# EAGLE design cSTER_Space_Robotic_Arm_Schematic (EAGLE 9.6.2)

## Sheet 1 of 5
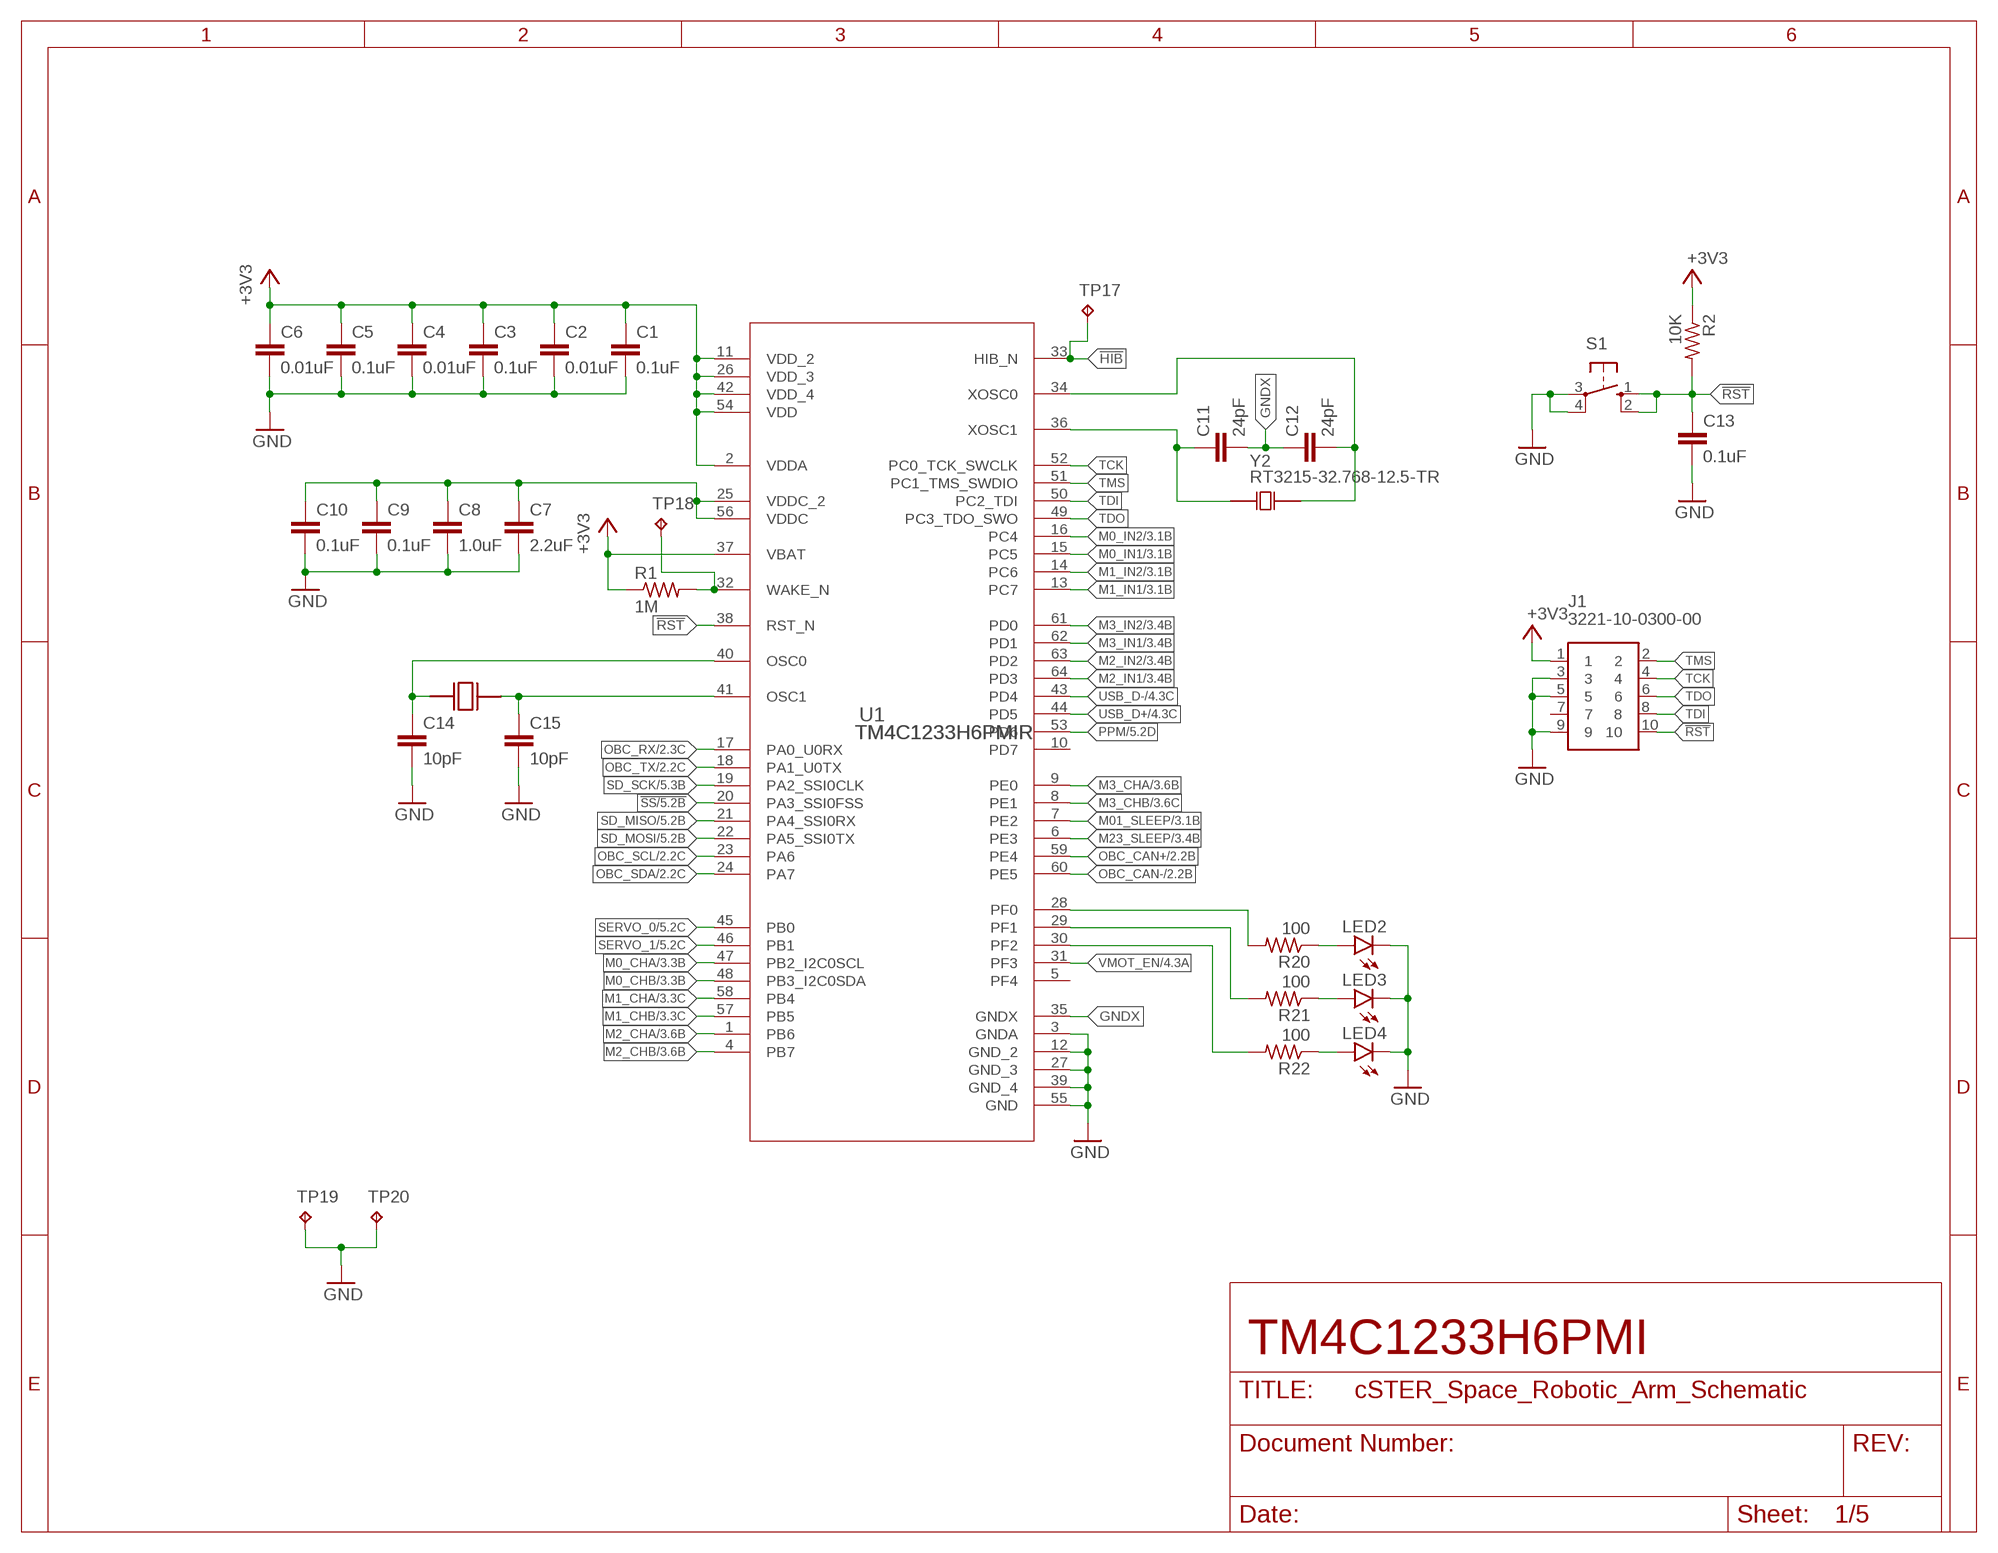
[diagram p0: schematic, sheet 1]

### Parts
C1  0.1uF  C-EUC0402K  [C0402K]
C2  0.01uF  C-EUC0402K  [C0402K]
C3  0.1uF  C-EUC0402K  [C0402K]
C4  0.01uF  C-EUC0402K  [C0402K]
C5  0.1uF  C-EUC0402K  [C0402K]
C6  0.01uF  C-EUC0402K  [C0402K]
C7  2.2uF  C-EUC0402K  [C0402K]
C8  1.0uF  C-EUC0402K  [C0402K]
C9  0.1uF  C-EUC0402K  [C0402K]
C10  0.1uF  C-EUC0402K  [C0402K]
C11  24pF  C-EUC0402K  [C0402K]
C12  24pF  C-EUC0402K  [C0402K]
C13  0.1uF  C-EUC0603  [C0603]
C14  10pF  C-EUC0402K  [C0402K]
C15  10pF  C-EUC0402K  [C0402K]
J1  3221-10-0300-00  [3221-10-0300-00]
LED2  LEDCHIPLED_0805  [CHIPLED_0805]
LED3  LEDCHIPLED_0805  [CHIPLED_0805]
LED4  LEDCHIPLED_0805  [CHIPLED_0805]
R1  1M  R-US_R0402  [R0402]
R2  10K  R-US_R0603  [R0603]
R20  100  R-US_R0603  [R0603]
R21  100  R-US_R0603  [R0603]
R22  100  R-US_R0603  [R0603]
S1  10-XX  [B3F-10XX]
TP17  TPPAD1-13  [P1-13]
TP18  TPPAD1-13  [P1-13]
TP19  TPPAD1-13  [P1-13]
TP20  TPPAD1-13  [P1-13]
U1  TM4C1233H6PMIR  [PM0064A_N]
Y1  ECS-160-9-42-CKM-TR  [XTAL_ECS-160-9-42-CKM-TR]
Y2  RT3215-32.768-12.5-TR  [RT3215-32.768-12.5-TR]

### Nets
!HIB: TP17.TP U1.33(HIB_N)
!RST: C13.1 J1.10 R2.2 S1.1(S) S1.2(S1) U1.38(RST_N)
!SS: U1.20(PA3_SSI0FSS) ; also sheet 5
+3V3: C1.1 C2.1 C3.1 C4.1 C5.1 C6.1 J1.1 R1.1 R2.1 U1.2(VDDA) U1.11(VDD_2) U1.26(VDD_3) U1.37(VBAT) U1.42(VDD_4) U1.54(VDD) ; also sheet 2,3,4,5
GND: C1.2 C2.2 C3.2 C4.2 C5.2 C6.2 C7.2 C8.2 C9.2 C10.2 C13.2 C14.2 C15.2 J1.3 J1.5 J1.9 LED2.C LED3.C LED4.C S1.3(P) S1.4(P1) TP19.TP TP20.TP U1.3(GNDA) U1.12(GND_2) U1.27(GND_3) U1.39(GND_4) U1.55(GND) ; also sheet 2,3,4,5
GNDX: C11.2 C12.1 U1.35(GNDX)
M0_CHA: U1.47(PB2_I2C0SCL) ; also sheet 3
M0_CHB: U1.48(PB3_I2C0SDA) ; also sheet 3
M0_IN1: U1.15(PC5) ; also sheet 3
M0_IN2: U1.16(PC4) ; also sheet 3
M1_CHA: U1.58(PB4) ; also sheet 3
M1_CHB: U1.57(PB5) ; also sheet 3
M1_IN1: U1.13(PC7) ; also sheet 3
M1_IN2: U1.14(PC6) ; also sheet 3
M01_SLEEP: U1.7(PE2) ; also sheet 3
M2_CHA: U1.1(PB6) ; also sheet 3
M2_CHB: U1.4(PB7) ; also sheet 3
M2_IN1: U1.64(PD3) ; also sheet 3
M2_IN2: U1.63(PD2) ; also sheet 3
M3_CHA: U1.9(PE0) ; also sheet 3
M3_CHB: U1.8(PE1) ; also sheet 3
M3_IN1: U1.62(PD1) ; also sheet 3
M3_IN2: U1.61(PD0) ; also sheet 3
M23_SLEEP: U1.6(PE3) ; also sheet 3
N$1: C11.1 U1.36(XOSC1) Y2.1
N$2: C14.1 U1.40(OSC0) Y1.1
N$3: C12.2 U1.34(XOSC0) Y2.2
N$4: R1.2 TP18.TP U1.32(WAKE_N)
N$5: C7.1 C8.1 C9.1 C10.1 U1.25(VDDC_2) U1.56(VDDC)
N$6: C15.1 U1.41(OSC1) Y1.3
N$24: LED2.A R20.1
N$28: LED3.A R21.1
N$34: LED4.A R22.1
N$38: R20.2 U1.28(PF0)
N$39: R21.2 U1.29(PF1)
N$40: R22.2 U1.30(PF2)
OBC_CAN+: U1.59(PE4) ; also sheet 2
OBC_CAN-: U1.60(PE5) ; also sheet 2
OBC_RX: U1.17(PA0_U0RX) ; also sheet 2
OBC_SCL: U1.23(PA6) ; also sheet 2
OBC_SDA: U1.24(PA7) ; also sheet 2
OBC_TX: U1.18(PA1_U0TX) ; also sheet 2
PPM: U1.53(PD6) ; also sheet 5
SD_MISO: U1.21(PA4_SSI0RX) ; also sheet 5
SD_MOSI: U1.22(PA5_SSI0TX) ; also sheet 5
SD_SCK: U1.19(PA2_SSI0CLK) ; also sheet 5
SERVO_0: U1.45(PB0) ; also sheet 5
SERVO_1: U1.46(PB1) ; also sheet 5
TCK: J1.4 U1.52(PC0_TCK_SWCLK)
TDI: J1.8 U1.50(PC2_TDI)
TDO: J1.6 U1.49(PC3_TDO_SWO)
TMS: J1.2 U1.51(PC1_TMS_SWDIO)
USB_D+: U1.44(PD5) ; also sheet 4
USB_D-: U1.43(PD4) ; also sheet 4
VMOT_EN: U1.31(PF3) ; also sheet 4
Unconnected: J1.7 U1.5(PF4) U1.10(PD7)

### Notes on the sheet
- TM4C1233H6PMI

## Sheet 2 of 5
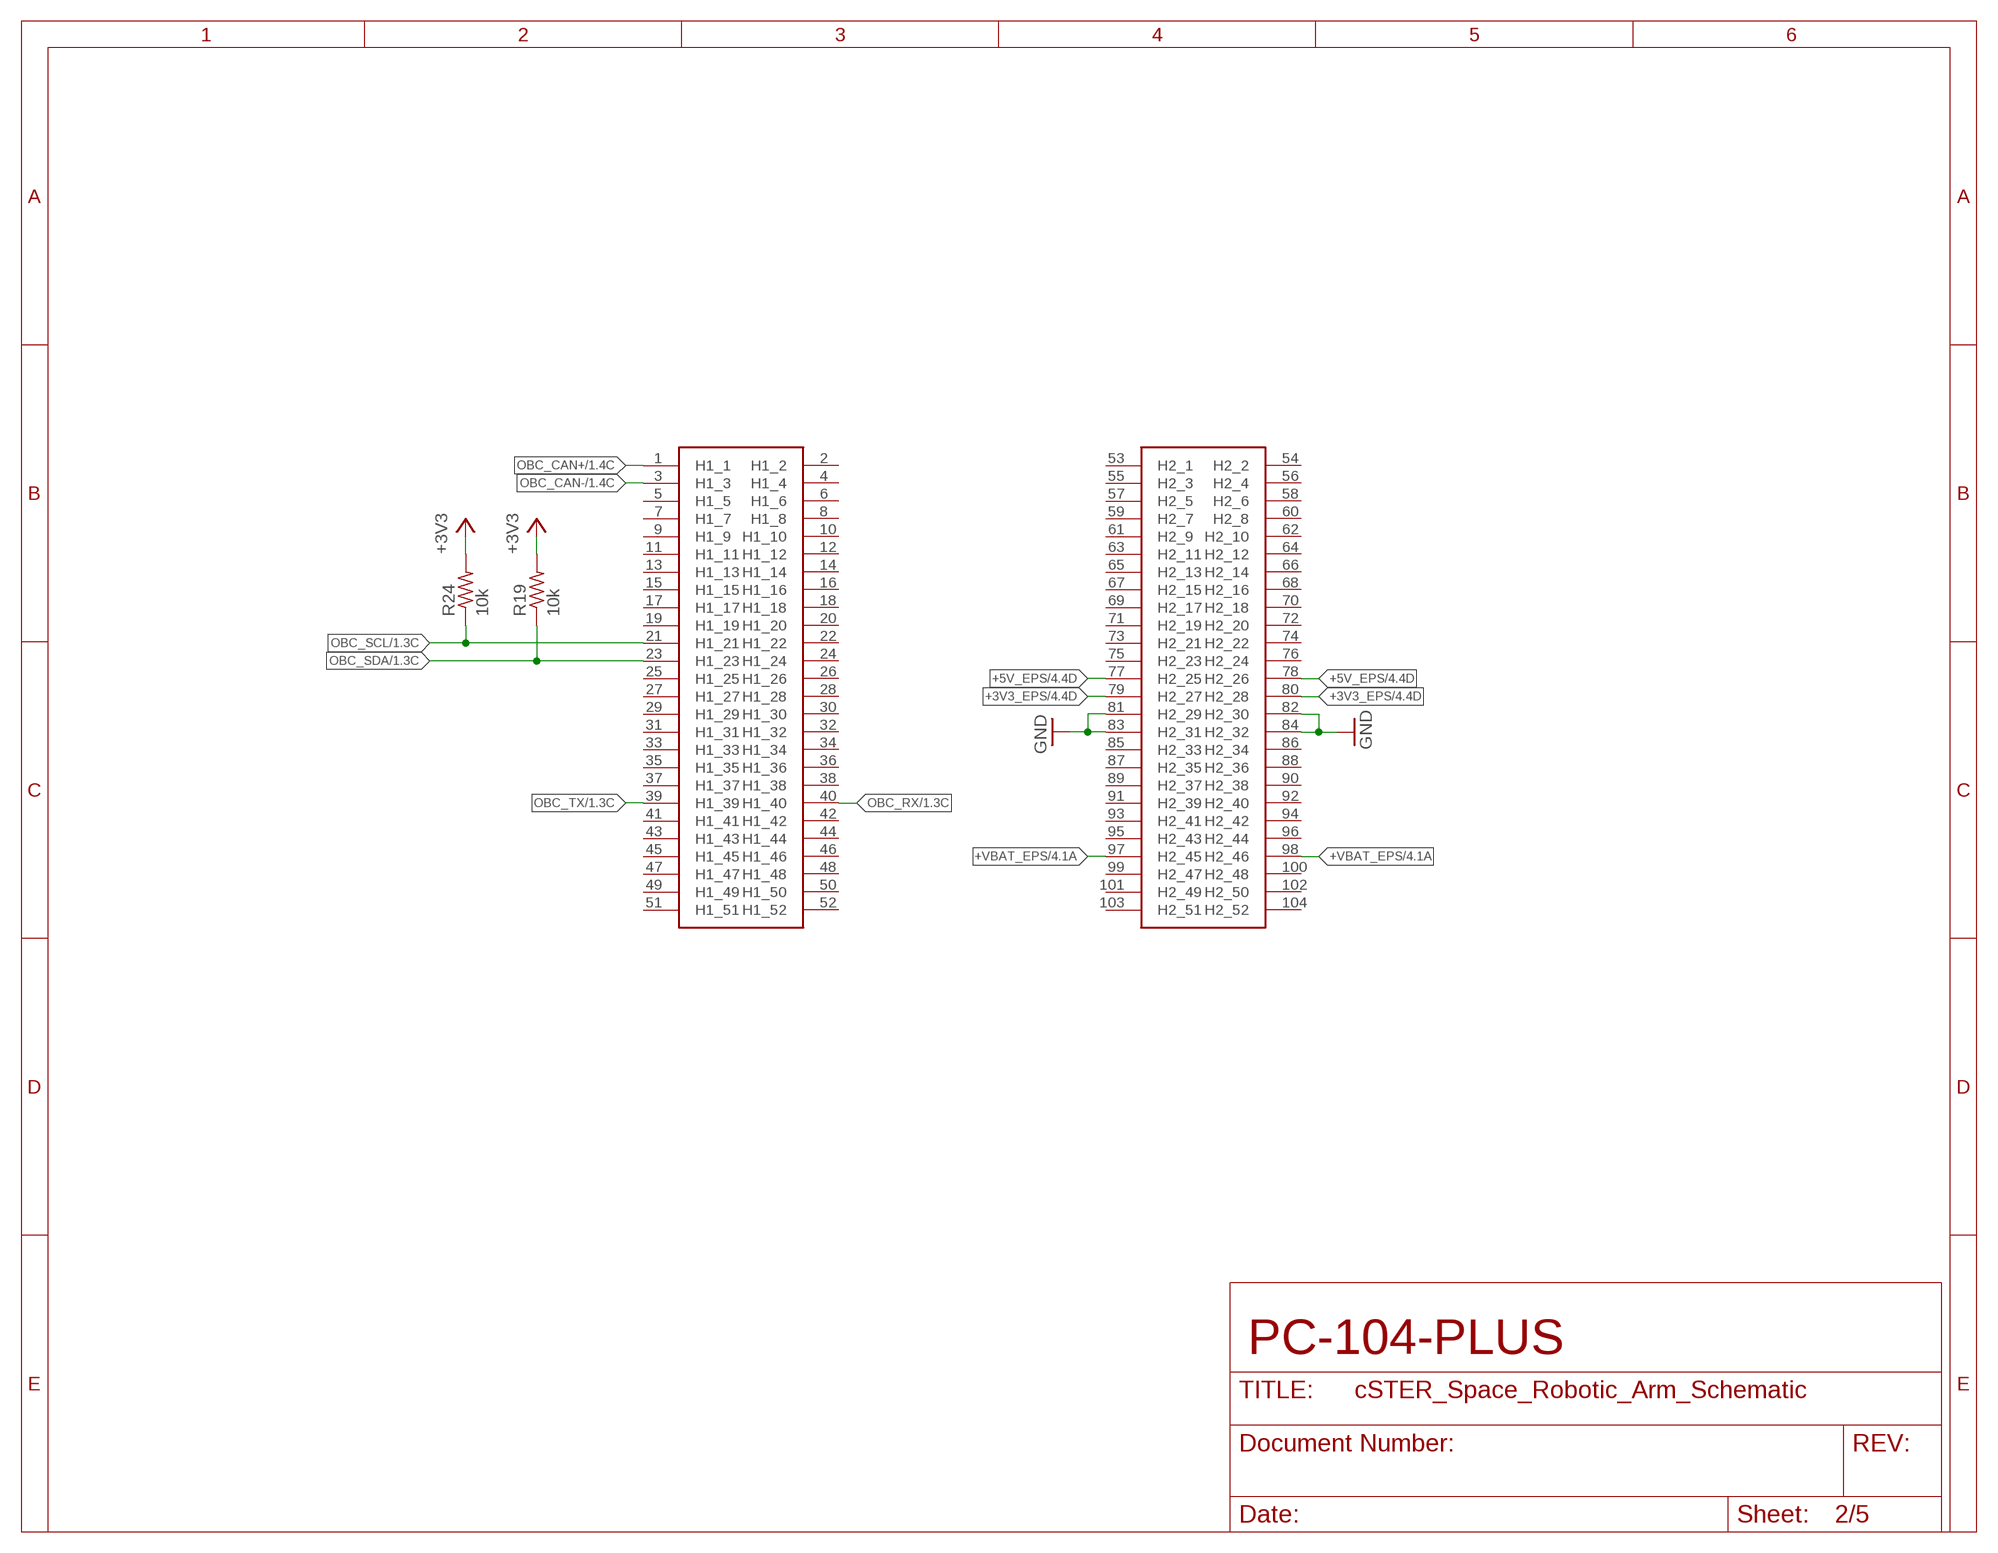
[diagram p1: schematic, sheet 2]

### Parts
J2  PC-104-PLUS  [PC-104-PLUS]
R19  10k  R-US_R0603  [R0603]
R24  10k  R-US_R0603  [R0603]

### Nets
+3V3: R19.2 R24.2 ; also sheet 1,3,4,5
+3V3_EPS: J2.79(H2_27) J2.80(H2_28) ; also sheet 4
+5V_EPS: J2.77(H2_25) J2.78(H2_26) ; also sheet 4
+VBAT_EPS: J2.97(H2_45) J2.98(H2_46) ; also sheet 4
GND: J2.81(H2_29) J2.82(H2_30) J2.83(H2_31) J2.84(H2_32) ; also sheet 1,3,4,5
OBC_CAN+: J2.1(H1_1) ; also sheet 1
OBC_CAN-: J2.3(H1_3) ; also sheet 1
OBC_RX: J2.40(H1_40) ; also sheet 1
OBC_SCL: J2.21(H1_21) R24.1 ; also sheet 1
OBC_SDA: J2.23(H1_23) R19.1 ; also sheet 1
OBC_TX: J2.39(H1_39) ; also sheet 1
Unconnected: J2.2(H1_2) J2.4(H1_4) J2.5(H1_5) J2.6(H1_6) J2.7(H1_7) J2.8(H1_8) J2.9(H1_9) J2.10(H1_10) J2.11(H1_11) J2.12(H1_12) J2.13(H1_13) J2.14(H1_14) J2.15(H1_15) J2.16(H1_16) J2.17(H1_17) J2.18(H1_18) J2.19(H1_19) J2.20(H1_20) J2.22(H1_22) J2.24(H1_24) J2.25(H1_25) J2.26(H1_26) J2.27(H1_27) J2.28(H1_28) J2.29(H1_29) J2.30(H1_30) J2.31(H1_31) J2.32(H1_32) J2.33(H1_33) J2.34(H1_34) J2.35(H1_35) J2.36(H1_36) J2.37(H1_37) J2.38(H1_38) J2.41(H1_41) J2.42(H1_42) J2.43(H1_43) J2.44(H1_44) J2.45(H1_45) J2.46(H1_46) J2.47(H1_47) J2.48(H1_48) J2.49(H1_49) J2.50(H1_50) J2.51(H1_51) J2.52(H1_52) J2.53(H2_1) J2.54(H2_2) J2.55(H2_3) J2.56(H2_4) J2.57(H2_5) J2.58(H2_6) J2.59(H2_7) J2.60(H2_8) J2.61(H2_9) J2.62(H2_10) J2.63(H2_11) J2.64(H2_12) J2.65(H2_13) J2.66(H2_14) J2.67(H2_15) J2.68(H2_16) J2.69(H2_17) J2.70(H2_18) J2.71(H2_19) J2.72(H2_20) J2.73(H2_21) J2.74(H2_22) J2.75(H2_23) J2.76(H2_24) J2.85(H2_33) J2.86(H2_34) J2.87(H2_35) J2.88(H2_36) J2.89(H2_37) J2.90(H2_38) J2.91(H2_39) J2.92(H2_40) J2.93(H2_41) J2.94(H2_42) J2.95(H2_43) J2.96(H2_44) J2.99(H2_47) J2.100(H2_48) J2.101(H2_49) J2.102(H2_50) J2.103(H2_51) J2.104(H2_52)

### Notes on the sheet
- PC-104-PLUS

## Sheet 3 of 5
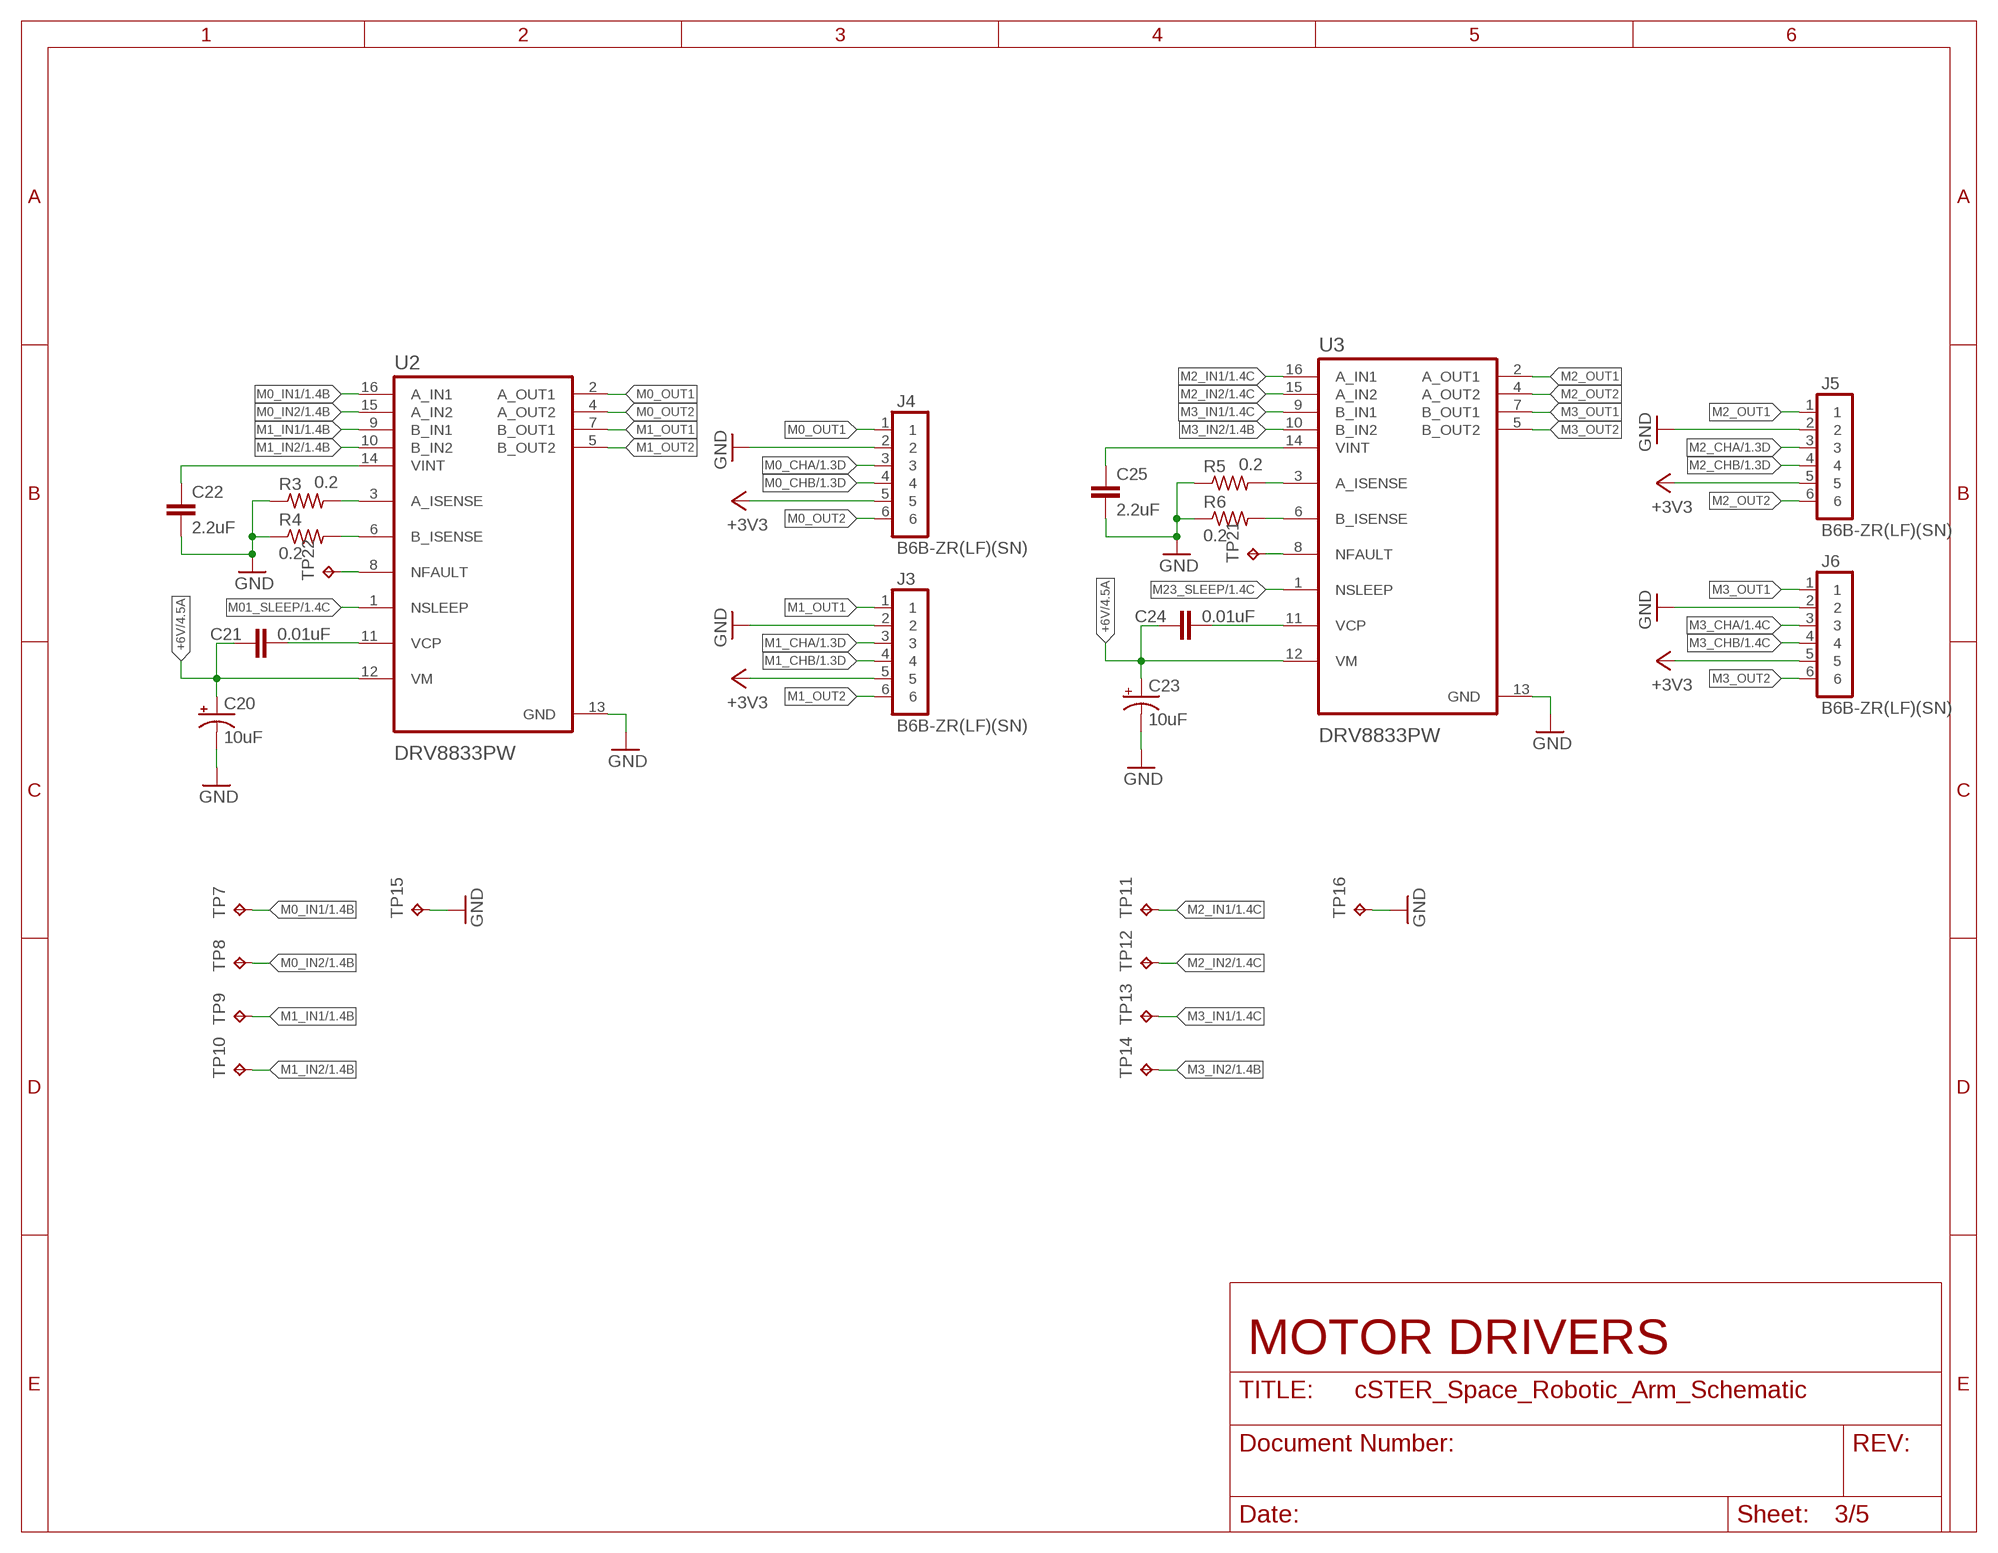
[diagram p2: schematic, sheet 3]

### Parts
C20  10uF  CPOL-USCT3216  [CT3216]
C21  0.01uF  C-EUC0805  [C0805]
C22  2.2uF  C-EUC0603  [C0603]
C23  10uF  CPOL-USCT3216  [CT3216]
C24  0.01uF  C-EUC0805  [C0805]
C25  2.2uF  C-EUC0603  [C0603]
J3  B6B-ZR(LF)(SN)  [JST_B6B-ZR(LF)(SN)]
J4  B6B-ZR(LF)(SN)  [JST_B6B-ZR(LF)(SN)]
J5  B6B-ZR(LF)(SN)  [JST_B6B-ZR(LF)(SN)]
J6  B6B-ZR(LF)(SN)  [JST_B6B-ZR(LF)(SN)]
R3  0.2  R-US_R1206  [R1206]
R4  0.2  R-US_R1206  [R1206]
R5  0.2  R-US_R1206  [R1206]
R6  0.2  R-US_R1206  [R1206]
TP7  TPPAD1-13  [P1-13]
TP8  TPPAD1-13  [P1-13]
TP9  TPPAD1-13  [P1-13]
TP10  TPPAD1-13  [P1-13]
TP11  TPPAD1-13  [P1-13]
TP12  TPPAD1-13  [P1-13]
TP13  TPPAD1-13  [P1-13]
TP14  TPPAD1-13  [P1-13]
TP15  TPPAD1-13  [P1-13]
TP16  TPPAD1-13  [P1-13]
TP21  TPPAD1-13  [P1-13]
TP22  TPPAD1-13  [P1-13]
U2  DRV8833PW  [SOP65P640X120-16N]
U3  DRV8833PW  [SOP65P640X120-16N]

### Nets
+3V3: J3.5 J4.5 J5.5 J6.5 ; also sheet 1,2,4,5
+6V: C20.+ C21.1 C23.+ C24.1 U2.12(VM) U3.12(VM) ; also sheet 4
GND: C20.- C22.2 C23.- C25.2 J3.2 J4.2 J5.2 J6.2 R3.1 R4.1 R5.1 R6.1 TP15.TP TP16.TP U2.13(GND) U3.13(GND) ; also sheet 1,2,4,5
M0_CHA: J4.3 ; also sheet 1
M0_CHB: J4.4 ; also sheet 1
M0_IN1: TP7.TP U2.16(A_IN1) ; also sheet 1
M0_IN2: TP8.TP U2.15(A_IN2) ; also sheet 1
M0_OUT1: J4.1 U2.2(A_OUT1)
M0_OUT2: J4.6 U2.4(A_OUT2)
M1_CHA: J3.3 ; also sheet 1
M1_CHB: J3.4 ; also sheet 1
M1_IN1: TP9.TP U2.9(B_IN1) ; also sheet 1
M1_IN2: TP10.TP U2.10(B_IN2) ; also sheet 1
M1_OUT1: J3.1 U2.7(B_OUT1)
M1_OUT2: J3.6 U2.5(B_OUT2)
M01_SLEEP: U2.1(NSLEEP) ; also sheet 1
M2_CHA: J5.3 ; also sheet 1
M2_CHB: J5.4 ; also sheet 1
M2_IN1: TP11.TP U3.16(A_IN1) ; also sheet 1
M2_IN2: TP12.TP U3.15(A_IN2) ; also sheet 1
M2_OUT1: J5.1 U3.2(A_OUT1)
M2_OUT2: J5.6 U3.4(A_OUT2)
M3_CHA: J6.3 ; also sheet 1
M3_CHB: J6.4 ; also sheet 1
M3_IN1: TP13.TP U3.9(B_IN1) ; also sheet 1
M3_IN2: TP14.TP U3.10(B_IN2) ; also sheet 1
M3_OUT1: J6.1 U3.7(B_OUT1)
M3_OUT2: J6.6 U3.5(B_OUT2)
M23_SLEEP: U3.1(NSLEEP) ; also sheet 1
N$8: R3.2 U2.3(A_ISENSE)
N$9: R4.2 U2.6(B_ISENSE)
N$10: C21.2 U2.11(VCP)
N$12: C22.1 U2.14(VINT)
N$13: R5.2 U3.3(A_ISENSE)
N$14: R6.2 U3.6(B_ISENSE)
N$15: C24.2 U3.11(VCP)
N$16: TP21.TP U3.8(NFAULT)
N$17: C25.1 U3.14(VINT)
N$18: TP22.TP U2.8(NFAULT)

### Notes on the sheet
- MOTOR DRIVERS

## Sheet 4 of 5
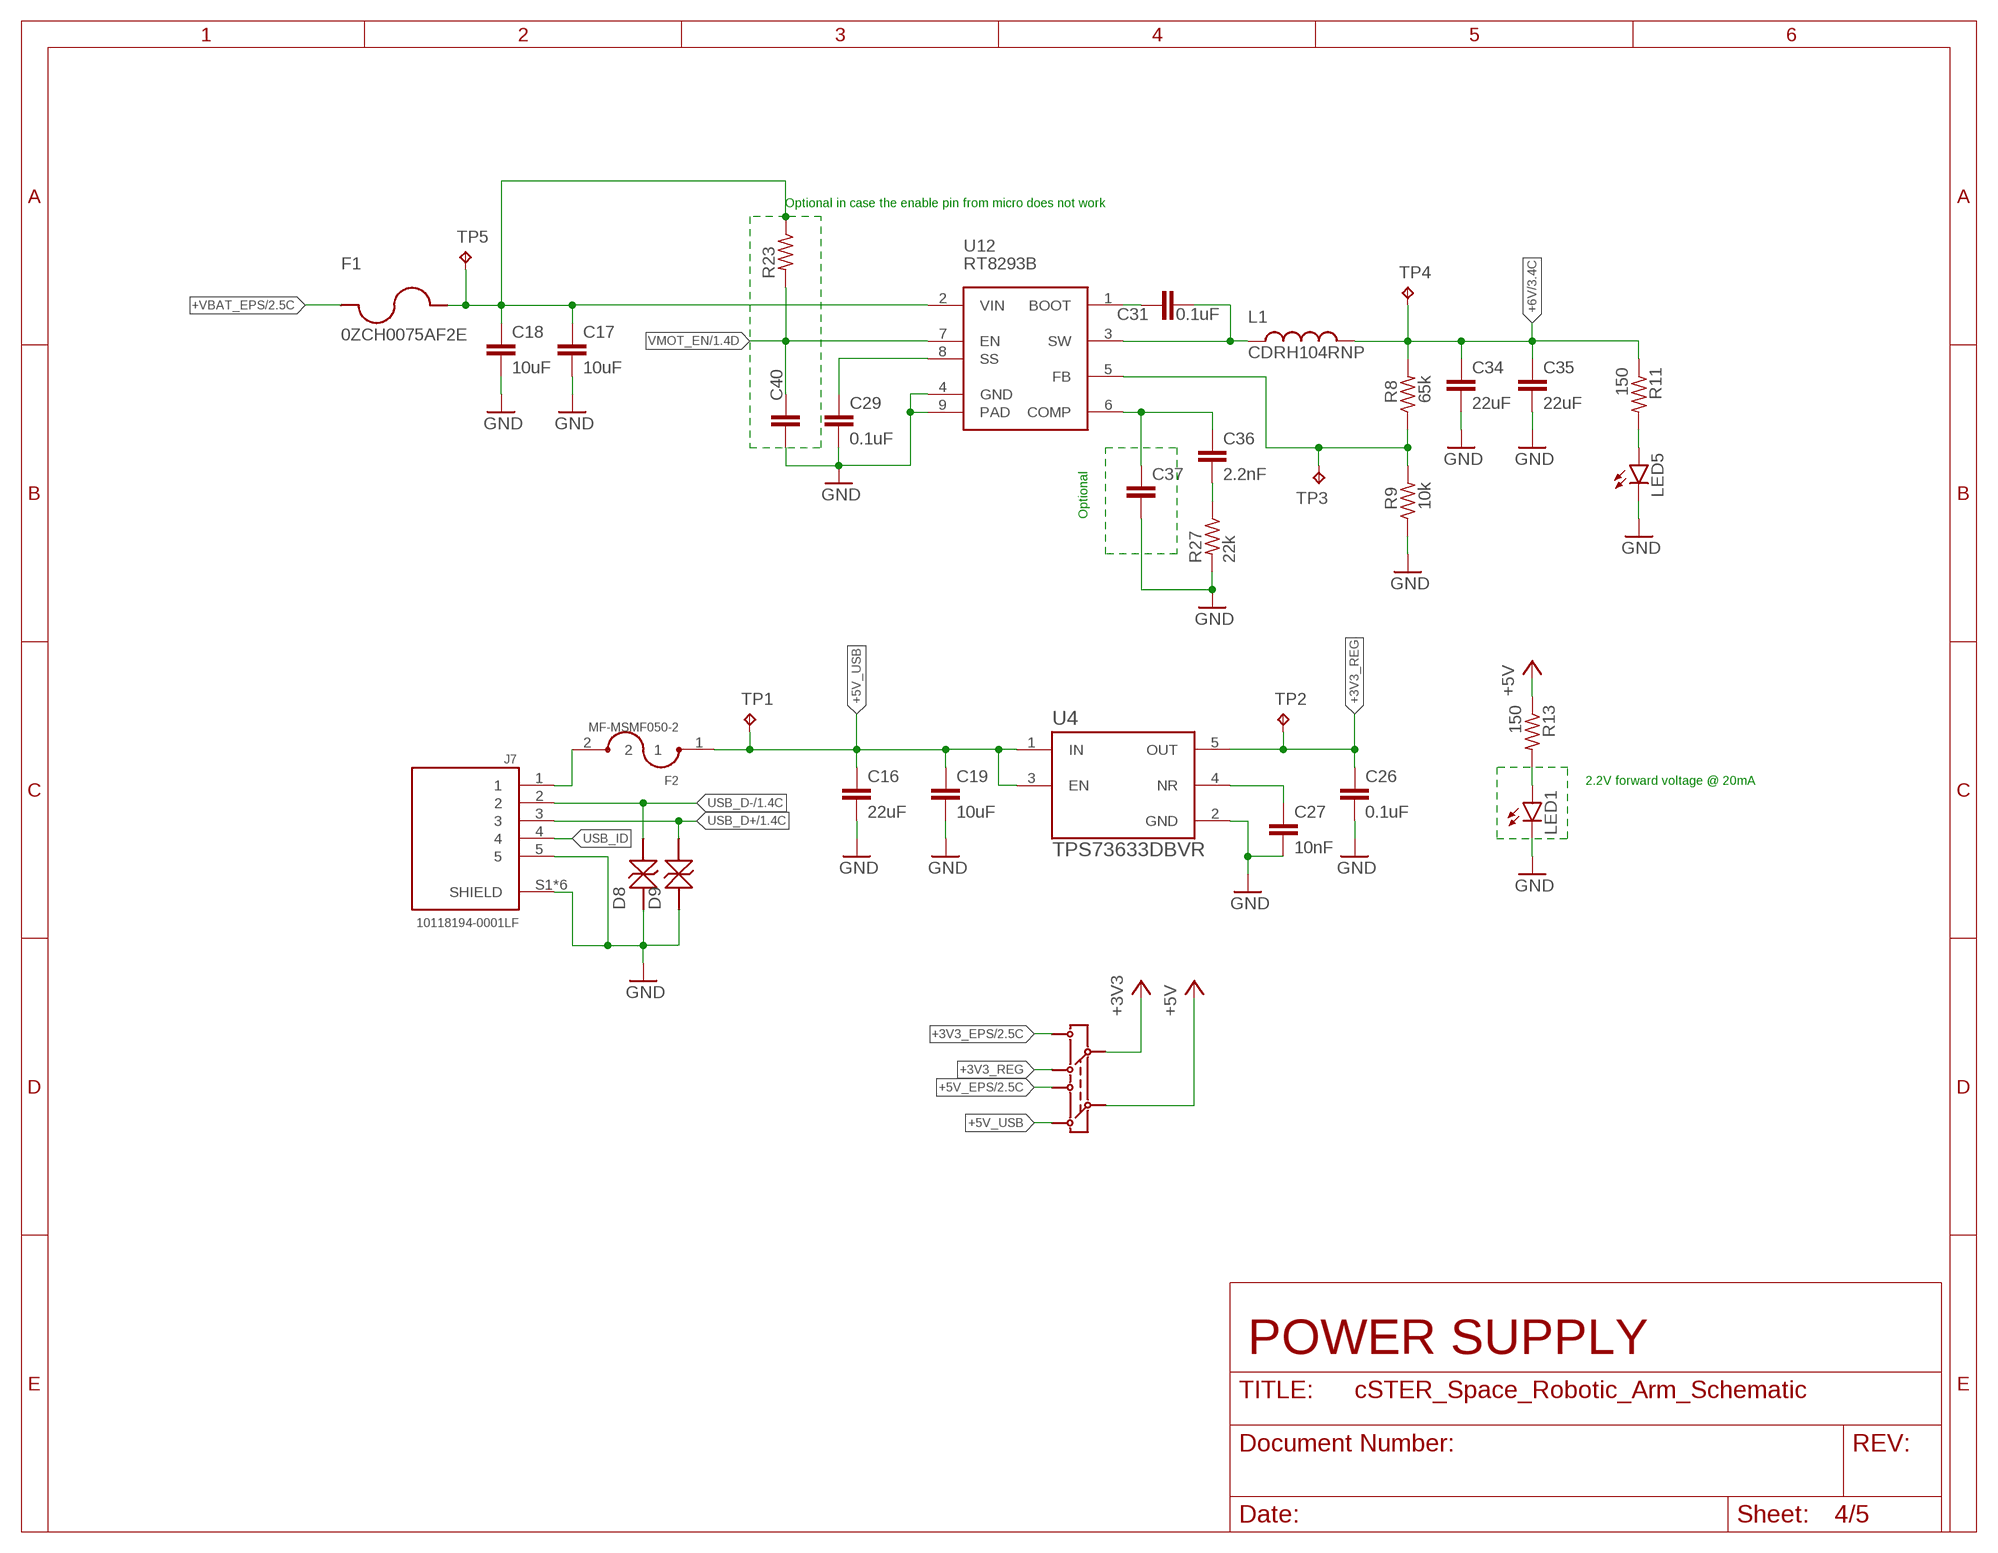
[diagram p3: schematic, sheet 4]

### Parts
C16  22uF  C-EUC1206  [C1206]
C17  10uF  C-EUC1206  [C1206]
C18  10uF  C-EUC1206  [C1206]
C19  10uF  C-EUC0603  [C0603]
C26  0.1uF  C-EUC0603  [C0603]
C27  10nF  C-EUC0603  [C0603]
C29  0.1uF  C-EUC0603  [C0603]
C31  0.1uF  C-EUC0603  [C0603]
C34  22uF  C-EUC1206  [C1206]
C35  22uF  C-EUC1206  [C1206]
C36  2.2nF  C-EUC0603  [C0603]
C37  C-EUC0603  [C0603]
C40  C-EUC0603  [C0603]
D8  CPDQC5V0R  [CPDQC5V0R]
D9  CPDQC5V0R  [CPDQC5V0R]
F1  0ZCH0075AF2E  [0ZCH0075AF2E]
F2  MF-MSMF050-2  [FUSM4632X85]
J7  10118194-0001LF  [AMPHENOL_10118194-0001LF]
L1  CDRH104RNP  [CDRH104RNP]
LED1  LEDCHIPLED_0805  [CHIPLED_0805]
LED5  LEDCHIPLED_0805  [CHIPLED_0805]
R8  65k  R-US_R0603  [R0603]
R9  10k  R-US_R0603  [R0603]
R11  150  R-US_R0603  [R0603]
R13  150  R-US_R0603  [R0603]
R23  R-US_R0603  [R0603]
R27  22k  R-US_R0603  [R0603]
TP1  TPPAD1-13  [P1-13]
TP2  TPPAD1-13  [P1-13]
TP3  TPPAD1-13  [P1-13]
TP4  TPPAD1-13  [P1-13]
TP5  TPPAD1-13  [P1-13]
U4  TPS73633DBVR  [SOT95P280X145-5N]
U12  RT8293B  [RT8293B]
U$1  JS202011CQN  [JS202011CQN]

### Nets
+3V3: U$1.5 ; also sheet 1,2,3,5
+3V3_EPS: U$1.6 ; also sheet 2
+3V3_REG: C26.1 TP2.TP U4.5(OUT) U$1.4
+5V: R13.1 U$1.2 ; also sheet 5
+5V_EPS: U$1.3 ; also sheet 2
+5V_USB: C16.1 C19.1 F2.1 TP1.TP U4.1(IN) U4.3(EN) U$1.1
+6V: C34.1 C35.1 L1.2 R8.2 R11.1 TP4.TP ; also sheet 3
+VBAT_EPS: F1.1 ; also sheet 2
GND: C16.2 C17.2 C18.2 C19.2 C26.2 C27.2 C29.2 C34.2 C35.2 C37.2 C40.1 D8.1 D9.1 J7.5 J7.S1(SHIELD) J7.S2(SHIELD) J7.S3(SHIELD) J7.S4(SHIELD) J7.S5(SHIELD) J7.S6(SHIELD) LED1.C LED5.C R9.1 R27.2 U4.2(GND) U12.4(GND) U12.9(PAD) ; also sheet 1,2,3,5
N$7: F2.2 J7.1
N$11: C31.1 U12.1(BOOT)
N$20: C27.1 U4.4(NR)
N$21: C29.1 U12.8(SS)
N$22: LED1.A R13.2
N$32: LED5.A R11.2
N$35: C31.2 L1.1 U12.3(SW)
N$36: R8.1 R9.2 TP3.TP U12.5(FB)
N$41: C36.1 C37.1 U12.6(COMP)
N$42: C36.2 R27.1
N$43: C17.1 C18.1 F1.2 R23.1 TP5.TP U12.2(VIN)
USB_D+: D9.2 J7.3 ; also sheet 1
USB_D-: D8.2 J7.2 ; also sheet 1
USB_ID: J7.4
VMOT_EN: C40.2 R23.2 U12.7(EN) ; also sheet 1

### Notes on the sheet
- Optional in case the enable pin from micro does not work
- Optional
- 2.2V forward voltage @ 20mA
- POWER SUPPLY

## Sheet 5 of 5
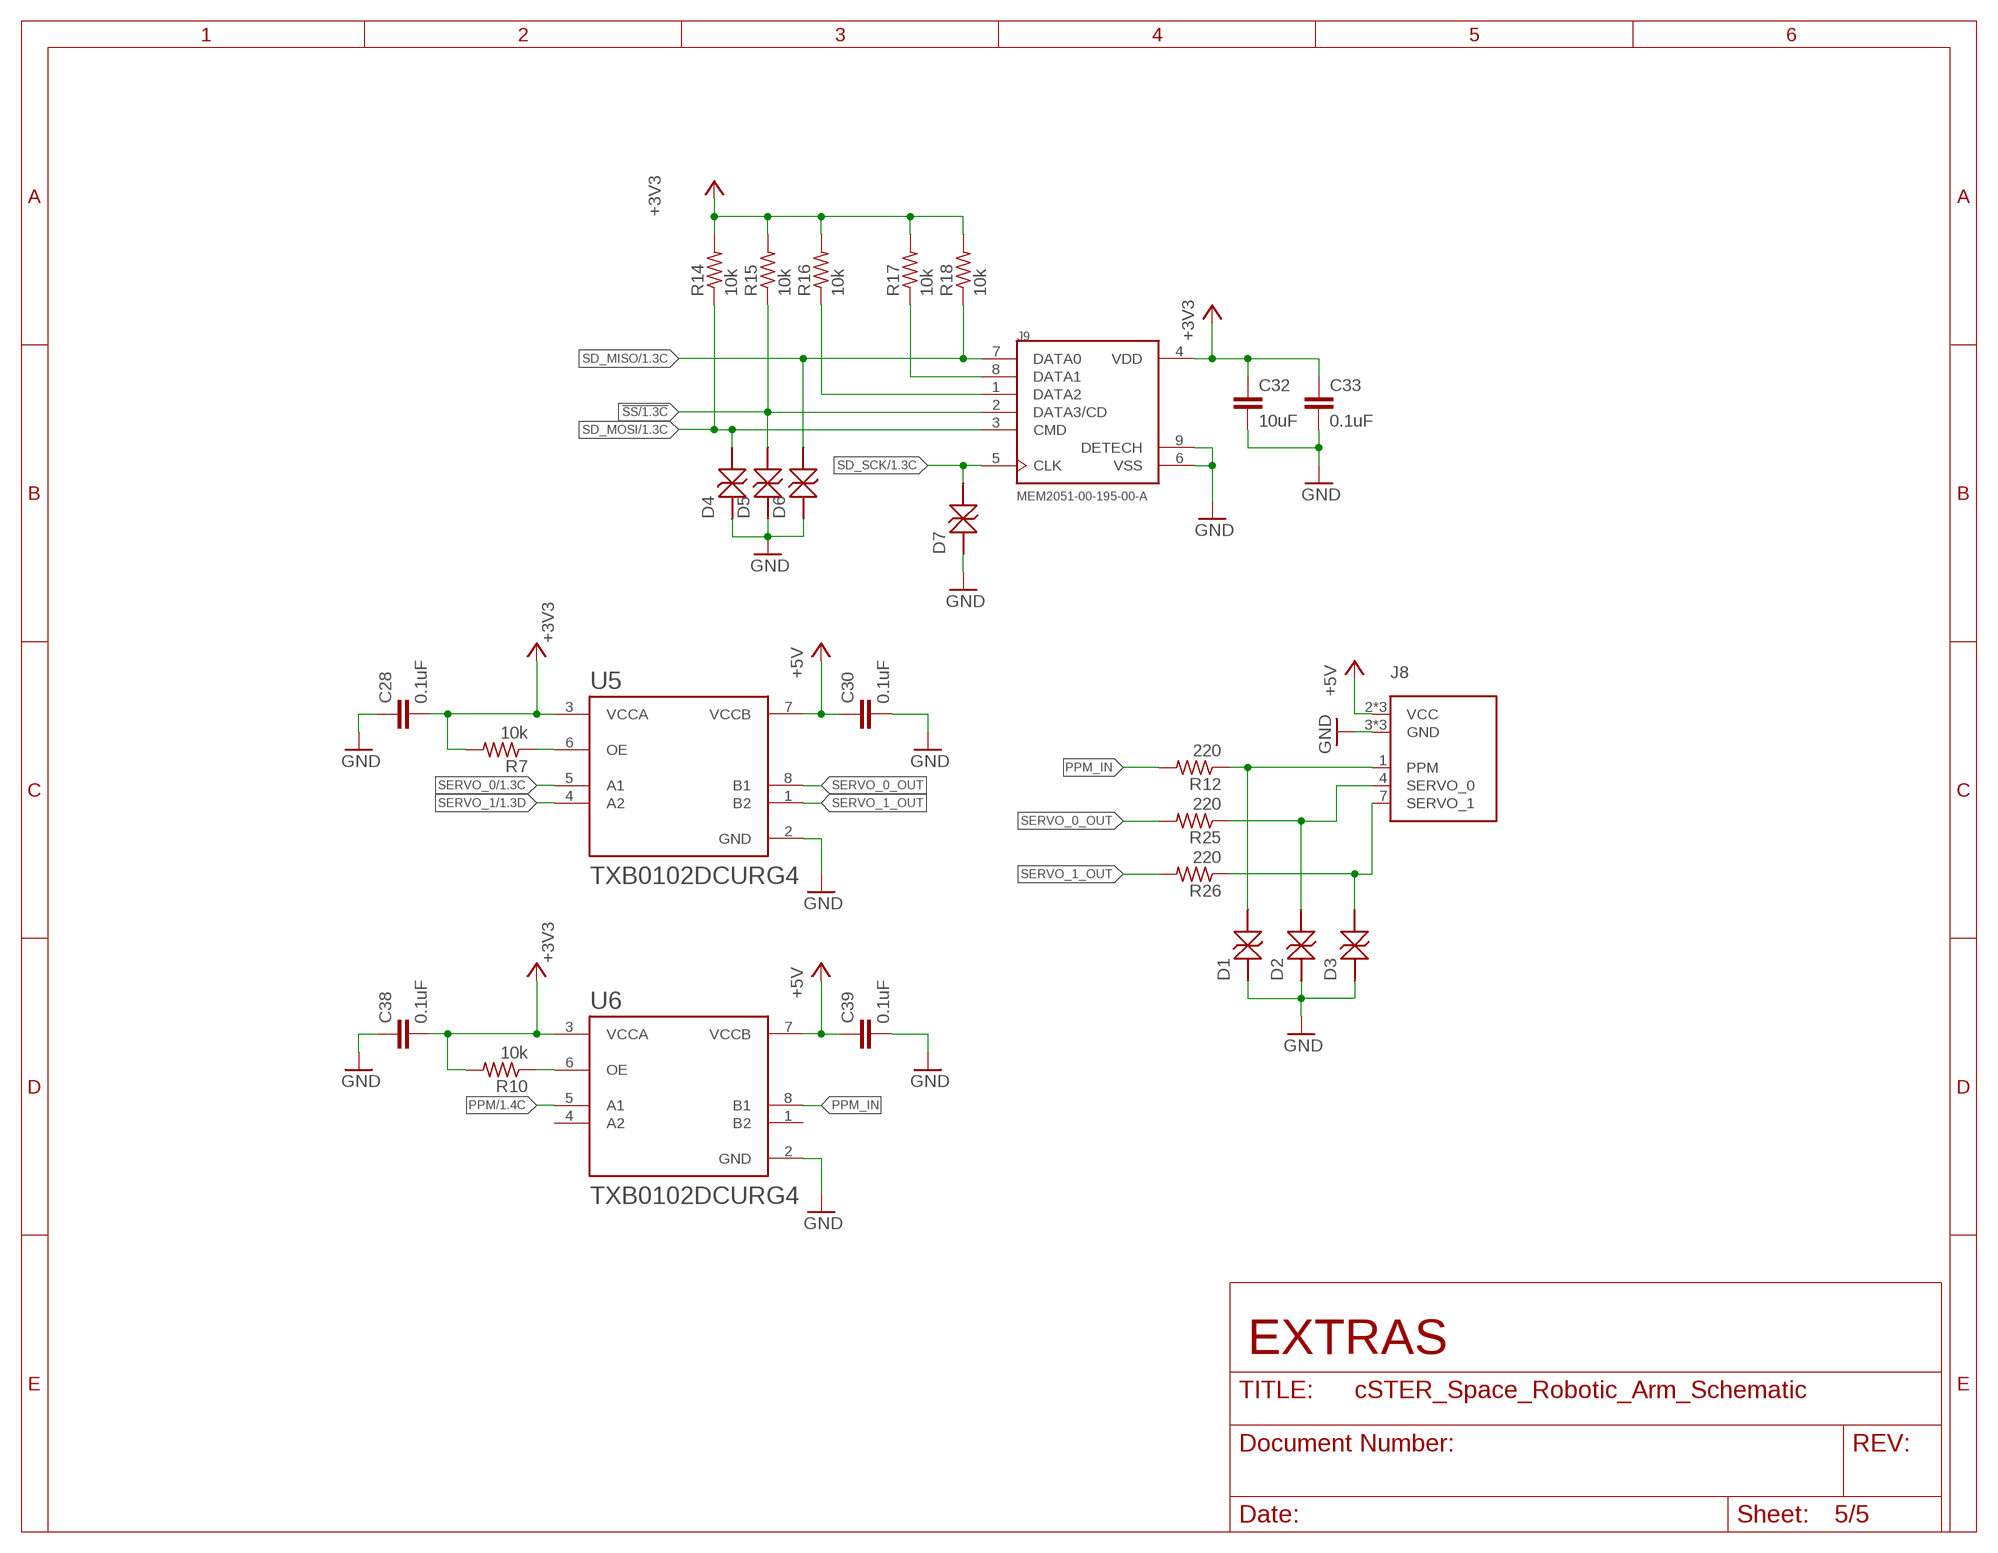
[diagram p4: schematic, sheet 5]

### Parts
C28  0.1uF  C-EUC0402K  [C0402K]
C30  0.1uF  C-EUC0402K  [C0402K]
C32  10uF  C-EUC0603  [C0603]
C33  0.1uF  C-EUC0603  [C0603]
C38  0.1uF  C-EUC0402K  [C0402K]
C39  0.1uF  C-EUC0402K  [C0402K]
D1  CPDQC5V0R  [CPDQC5V0R]
D2  CPDQC5V0R  [CPDQC5V0R]
D3  CPDQC5V0R  [CPDQC5V0R]
D4  CPDQC5V0R  [CPDQC5V0R]
D5  CPDQC5V0R  [CPDQC5V0R]
D6  CPDQC5V0R  [CPDQC5V0R]
D7  CPDQC5V0R  [CPDQC5V0R]
J8  ROBOT_PORT  [ROBOT_PORT]
J9  MEM2051-00-195-00-A  [GCT_MEM2051-00-195-00-A]
R7  10k  R-US_R0402  [R0402]
R10  10k  R-US_R0402  [R0402]
R12  220  R-US_R0603  [R0603]
R14  10k  R-US_R0603  [R0603]
R15  10k  R-US_R0603  [R0603]
R16  10k  R-US_R0603  [R0603]
R17  10k  R-US_R0603  [R0603]
R18  10k  R-US_R0603  [R0603]
R25  220  R-US_R0603  [R0603]
R26  220  R-US_R0603  [R0603]
U5  TXB0102DCURG4  [SOP50P310X90-8N]
U6  TXB0102DCURG4  [SOP50P310X90-8N]

### Nets
!SS: D5.2 J9.2(DATA3/CD) R15.1 ; also sheet 1
+3V3: C28.2 C32.1 C33.1 C38.2 J9.4(VDD) R7.2 R10.2 R14.2 R15.2 R16.2 R17.2 R18.2 U5.3(VCCA) U6.3(VCCA) ; also sheet 1,2,3,4
+5V: C30.1 C39.1 J8.2(VCC) J8.5(VCC) J8.8(VCC) U5.7(VCCB) U6.7(VCCB) ; also sheet 4
GND: C28.1 C30.2 C32.2 C33.2 C38.1 C39.2 D1.1 D2.1 D3.1 D4.1 D5.1 D6.1 D7.1 J8.3(GND) J8.6(GND) J8.9(GND) J9.6(VSS) J9.9(DETECH) U5.2(GND) U6.2(GND) ; also sheet 1,2,3,4
N$19: R7.1 U5.6(OE)
N$23: D3.2 J8.7(SERVO_1) R26.1
N$25: J9.8(DATA1) R17.1
N$26: J9.1(DATA2) R16.1
N$27: D2.2 J8.4(SERVO_0) R25.1
N$30: R10.1 U6.6(OE)
N$31: D1.2 J8.1(PPM) R12.1
PPM: U6.5(A1) ; also sheet 1
PPM_IN: R12.2 U6.8(B1)
SD_MISO: D6.2 J9.7(DATA0) R18.1 ; also sheet 1
SD_MOSI: D4.2 J9.3(CMD) R14.1 ; also sheet 1
SD_SCK: D7.2 J9.5(CLK) ; also sheet 1
SERVO_0: U5.5(A1) ; also sheet 1
SERVO_0_OUT: R25.2 U5.8(B1)
SERVO_1: U5.4(A2) ; also sheet 1
SERVO_1_OUT: R26.2 U5.1(B2)
Unconnected: U6.1(B2) U6.4(A2)

### Notes on the sheet
- EXTRAS

## Library data of the parts
C1-C19 C21 C22 C24-C40 = rcl:C-EU: CAPACITOR, European symbol; SPICEPREFIX: C
C20 C23 = rcl:CPOL-US: POLARIZED CAPACITOR, American symbol; SPICEPREFIX: C
D1-D9 = CPDQC5V0R:CPDQC5V0R
F1 = 0ZCH0075AF2E:0ZCH0075AF2E
F2 = MF-MSMF050-2:MF-MSMF050-2: PTC Resettable Fuse 0.5A(hold) 1A(trip) 15V 100A 0.8W 0.15s 0.15Ohm SMD Solder Pad 1812 T/R; DESCRIPTION: Polymeric PTC Resettable Fuse 15V 500 mA Ih Surface Mount 1812 (4532 Metric), Concave; DIGI-KEY_PART_NUMBER: MF-MSMF050-2CT-ND; MF: Bourns; MP: MF-MSMF050-2; PACKAGE: 1812 Bourns; PURCHASE-URL: https://pricing.snapeda.com/search/part/MF-MSMF050-2/?ref=eda
J1 = 3221-10-0300-00:3221-10-0300-00
J2 = PC-104_plus:PC-104-PLUS
J3-J6 = B6B-ZR_LF__SN_:B6B-ZR(LF)(SN): ZR Series 1.5 mm Pitch 6 Position Through Hole Top Entry Shrouded Heade; DESCRIPTION: Connector Header Through Hole 6 position 0.059 (1.50mm); DIGI-KEY_PART_NUMBER: 455-1661-ND; MF: JST Sales; MP: B6B-ZR(LF)(SN); PACKAGE: None
J7 = 10118194-0001LF:10118194-0001LF: Micro Usb, 2.0 Type b, Rcpt, Smt; DESCRIPTION: USB - micro B USB 2.0 Receptacle Connector 5 Position Surface Mount, Right Angle; Through Hole; DIGI-KEY_PART_NUMBER: 609-4618-1-ND; MF: Amphenol ICC (FCI); MP: 10118194-0001LF; PACKAGE: None; PURCHASE-URL: https://pricing.snapeda.com/search/part/10118194-0001LF/?ref=eda
J8 = CUBESAT_PORT:ROBOT_PORT
J9 = MEM2051-00-195-00-A:MEM2051-00-195-00-A: Connector, Memory Card, Micro Sd, 8 Position, 1.1mm, Full Reel; DESCRIPTION: 9 (8 + 1) Position Card Connector microSD Surface Mount, Right Angle Gold, 1.95mm profile, Normally open switch, Push push, Top mount; MF: Global Connector Technology; MP: MEM2051-00-195-00-A; PACKAGE: None; PURCHASE-URL: https://pricing.snapeda.com/search/part/MEM2051-00-195-00-A/?ref=eda
L1 = CDRH104RNP:CDRH104RNP
LED1-LED5 = led:LED: LED OSRAM: - CHIPLED LG R971, LG N971, LY N971, LG Q971, LY Q971, LO R971, LY R971 LH N974, LH R974 LS Q976, LO Q976, LY Q976 LO Q996 - Hyper CHIPLED LW Q18S LB Q993, LB Q99A, LB R99A - SideLED LS A670, LO A670, LY A670, LG A670, LP A670 LB A673, LV A673, LT A673, LW A673 LH A674 LY A675 LS A676, LA A676, LO A676, LY A676, LW A676 LS A679, LY A679, LG A679 - Hyper Micro SIDELED® LS Y876, LA Y876, LO Y876, LY Y876 LT Y87S - SmartLED LW L88C, LW L88S LB L89C, LB L89S, LG L890 LS L89K, LO L89K, LY L89K LS L896, LA L896, LO L896, LY L896 - TOPLED LS T670, LO T670, LY T670, LG T670, LP T670 LSG T670, LSP T670, LSY T670, LOP T670, LYG T670 LG T671, LOG T671, LSG T671 LB T673, LV T673, LT T673, LW T673 LH T674 LS T676, LA T676, LO T676, LY T676, LB T676, LH T676, LSB T676, LW T676 LB T67C, LV T67C, LT T67C, LS T67K, LO T67K, LY T67K, LW E67C LS E67B, LA E67B, LO E67B, LY E67B, LB E67C, LV E67C, LT E67C LW T67C LS T679, LY T679, LG T679 LS T770, LO T770, LY T770, LG T770, LP T770 LB T773, LV T773, LT T773, LW T773 LH T774 LS E675, LA E675, LY E675, LS T675 LS T776, LA T776, LO T776, LY T776, LB T776 LHGB T686 LT T68C, LB T68C - Hyper Mini TOPLED® LB M676 - Mini TOPLED Santana® LG M470 LS M47K, LO M47K, LY M47K Source: http://www.osram.convergy.de LUXEON: - LUMILED® LXK2-PW12-R00, LXK2-PW12-S00, LXK2-PW14-U00, LXK2-PW14-V00 LXK2-PM12-R00, LXK2-PM12-S00, LXK2-PM14-U00 LXK2-PE12-Q00, LXK2-PE12-R00, LXK2-PE12-S00, LXK2-PE14-T00, LXK2-PE14-U00 LXK2-PB12-K00, LXK2-PB12-L00, LXK2-PB12-M00, LXK2-PB14-N00, LXK2-PB14-P00, LXK2-PB14-Q00 LXK2-PR12-L00, LXK2-PR12-M00, LXK2-PR14-Q00, LXK2-PR14-R00 LXK2-PD12-Q00, LXK2-PD12-R00, LXK2-PD12-S00 LXK2-PH12-R00, LXK2-PH12-S00 LXK2-PL12-P00, LXK2-PL12-Q00, LXK2-PL12-R00 Source: www.luxeon.com KINGBRIGHT: KA-3528ASYC Source: www.kingbright.com
R1-R27 = rcl:R-US_: RESISTOR, American symbol; SPICEPREFIX: R
S1 = switch-omron:10-XX: OMRON SWITCH; MPN: B3F-1000; OC_FARNELL: 176432; OC_NEWARK: 36M3542
TP1-TP5 TP7-TP22 = testpad:TP: Test pad
U1 = TM4C1233H6PMI:TM4C1233H6PMIR; COPYRIGHT: Copyright (C) 2021 Ultra Librarian. All rights reserved.; DIGI-KEY_PART_NUMBER_1: TM4C1233H6PMIR-ND; MANUFACTURER_PART_NUMBER: TM4C1233H6PMIR; MFR_NAME: Texas Instruments; REFDES: RefDes; TYPE: TYPE
U2 U3 = DRV8833PW:DRV8833PW; DESCRIPTION: 10.8-V, 2-A dual H-bridge motor driver with current regulation 16-TSSOP -40 to 85; DIGI-KEY_PART_NUMBER: 296-29394-5-ND; MF: Texas Instruments; MP: DRV8833PW; PACKAGE: TSSOP-16 Texas Instruments; PURCHASE-URL: https://pricing.snapeda.com/search/part/DRV8833PW/?ref=eda
U4 = TPS73633DBVR:TPS73633DBVR: 400-mA, high-accuracy, ultra-low-dropout voltage regulator with reverse current protection and enable 5-SOT-23 -40 to 125; DESCRIPTION: 400-mA, high-accuracy, ultra-low-dropout voltage regulator with reverse current protection & enable 5-SOT-23 -40 to 125; DIGI-KEY_PART_NUMBER: 296-27064-1-ND; MF: Texas Instruments; MP: TPS73633DBVR; PACKAGE: SOT-23-5 Texas Instruments; PURCHASE-URL: https://pricing.snapeda.com/search/part/TPS73633DBVR/?ref=eda
U5 U6 = TXB0102DCURG4:TXB0102DCURG4: 2-Bit Bidirectional Voltage-Level Shifter with Auto Direction Sensing and +/-15-kV ESD Protect 8-VSSOP -40 to 85; DESCRIPTION: 2-Bit Bidirectional Voltage-Level Shifter with Auto Direction Sensing and +/-15-kV ESD Protect 8-VSSOP -40 to 85; DIGI-KEY_PART_NUMBER: 296-52836-2-ND; MF: Texas Instruments; MP: TXB0102DCURG4; PACKAGE: VSSOP-8 Texas Instruments; PURCHASE-URL: https://pricing.snapeda.com/search/part/TXB0102DCURG4/?ref=eda
U12 = RT8293B:RT8293B
U$1 = JS202011CQN:JS202011CQN
Y1 = ECS-160-9-42-CKM-TR:ECS-160-9-42-CKM-TR: Crystal 4-SMD, No Lead; DESCRIPTION: 16 MHz ±10ppm Crystal 9pF 60 Ohms 4-SMD, No Lead; DIGI-KEY_PART_NUMBER: XC1611CT-ND; MF: ECS Inc.; MP: ECS-160-9-42-CKM-TR; PACKAGE: SMD-4 ECS International; PURCHASE-URL: https://pricing.snapeda.com/search/part/ECS-160-9-42-CKM-TR/?ref=eda
Y2 = RT3215-32.768-12.5-TR:RT3215-32.768-12.5-TR

## Board
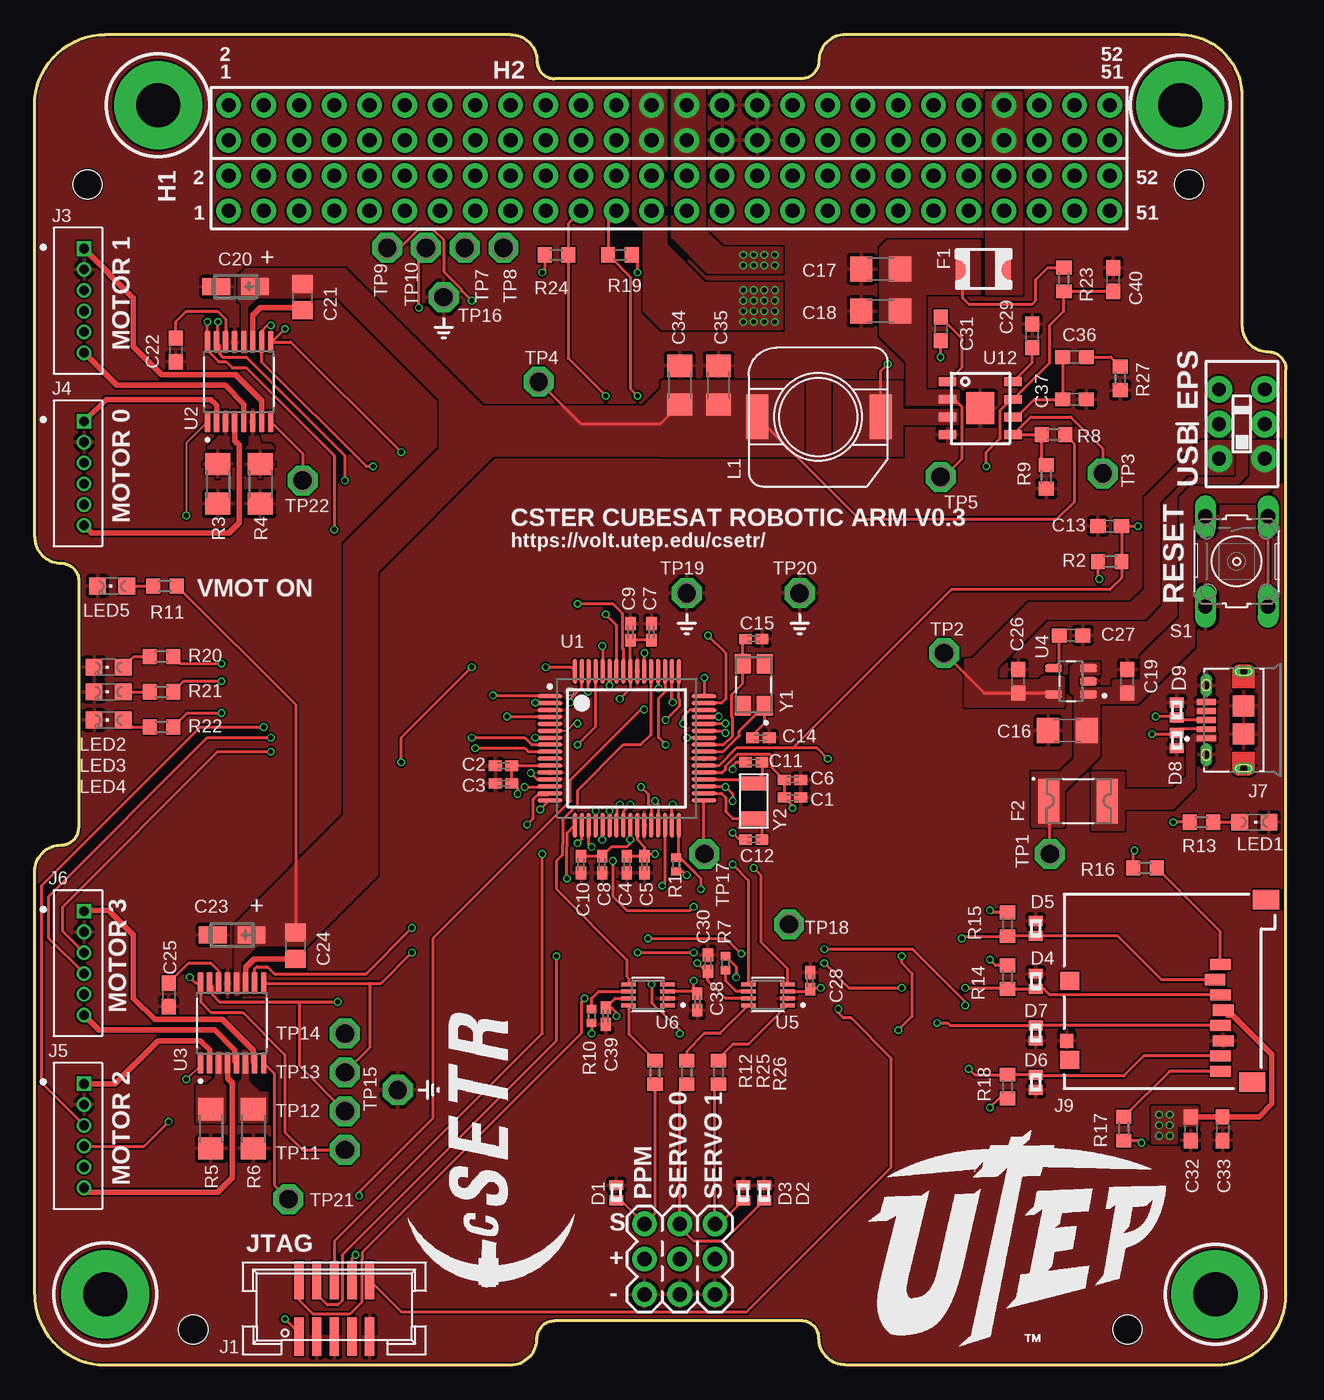
[diagram p5: board, top side]
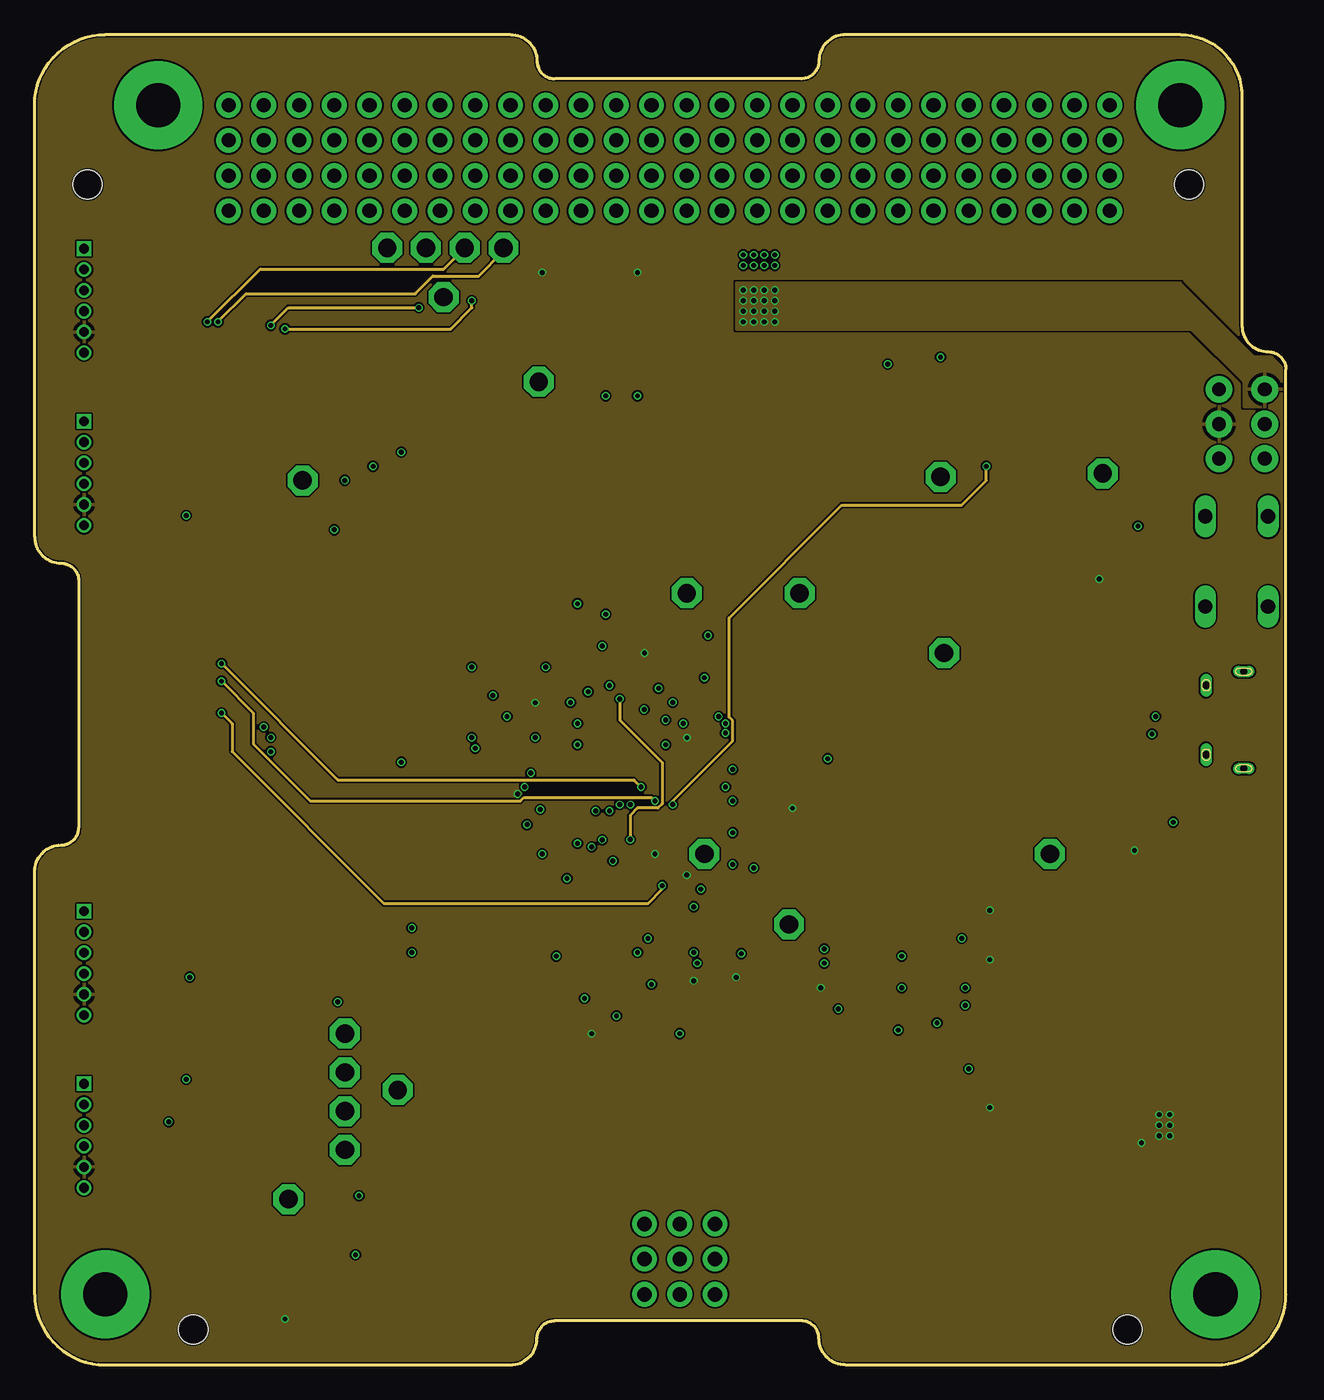
[diagram p6: board, inner layer Route2]
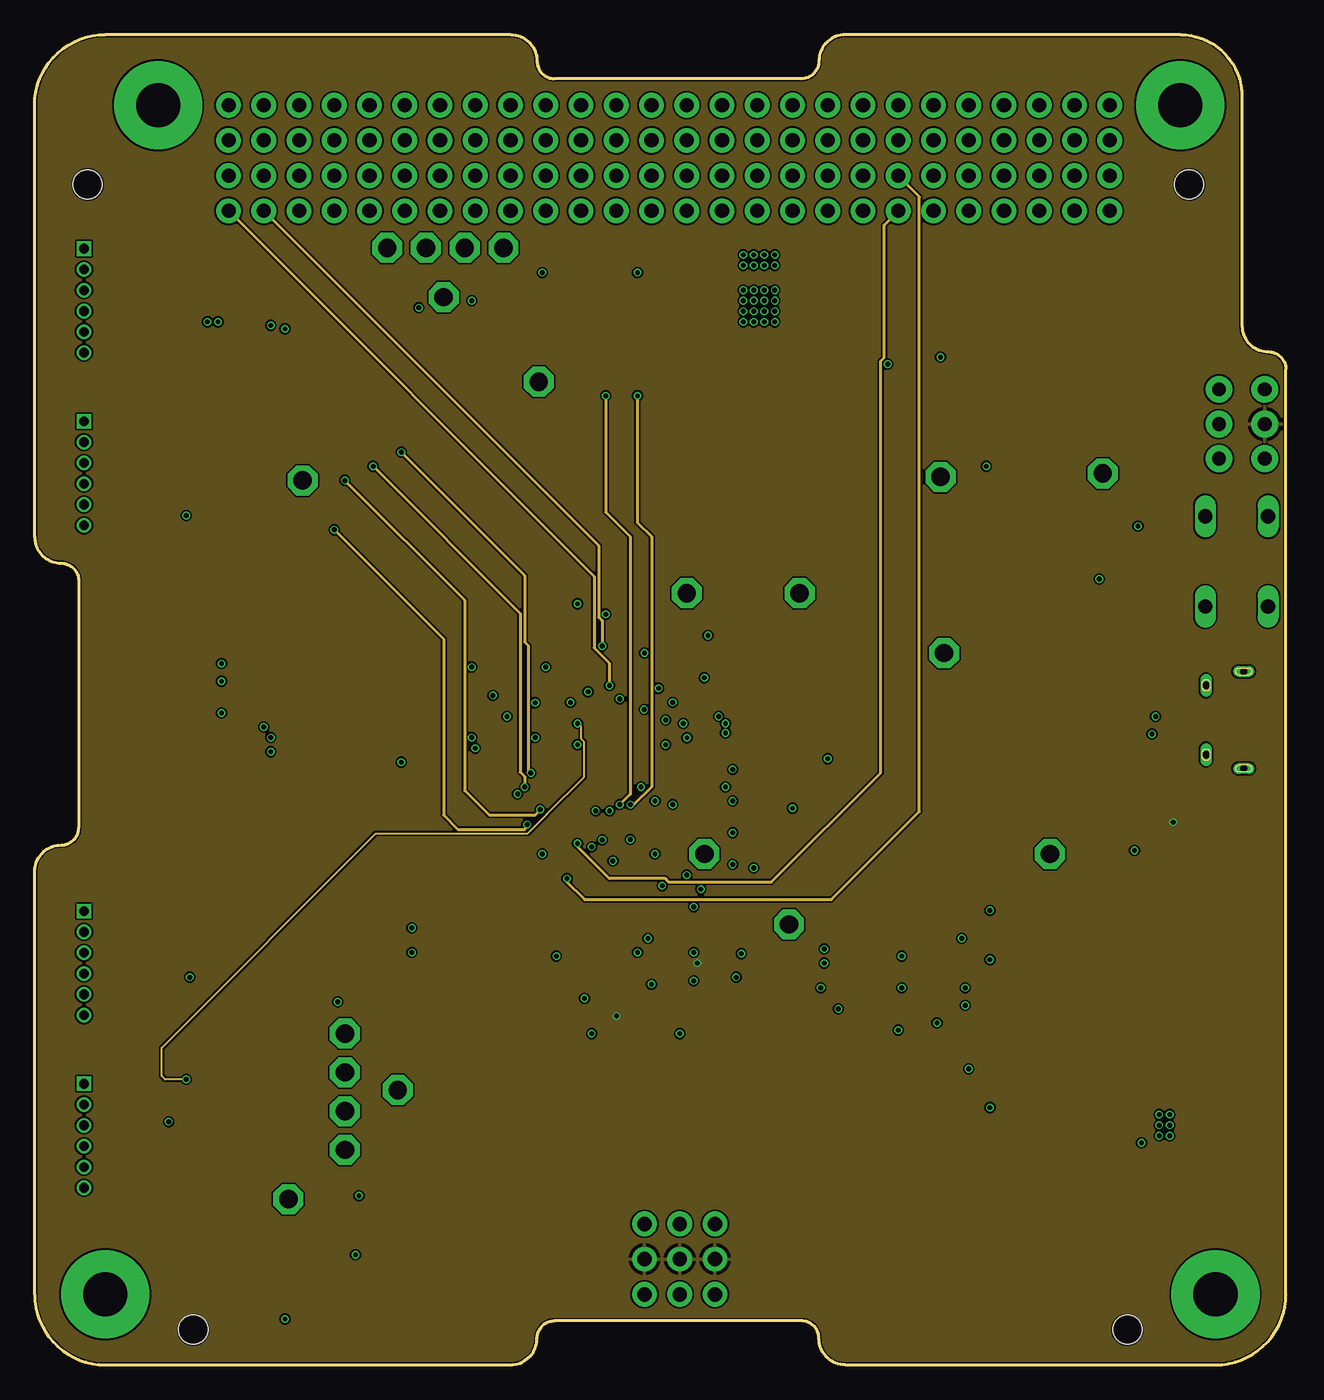
[diagram p7: board, inner layer Route15]
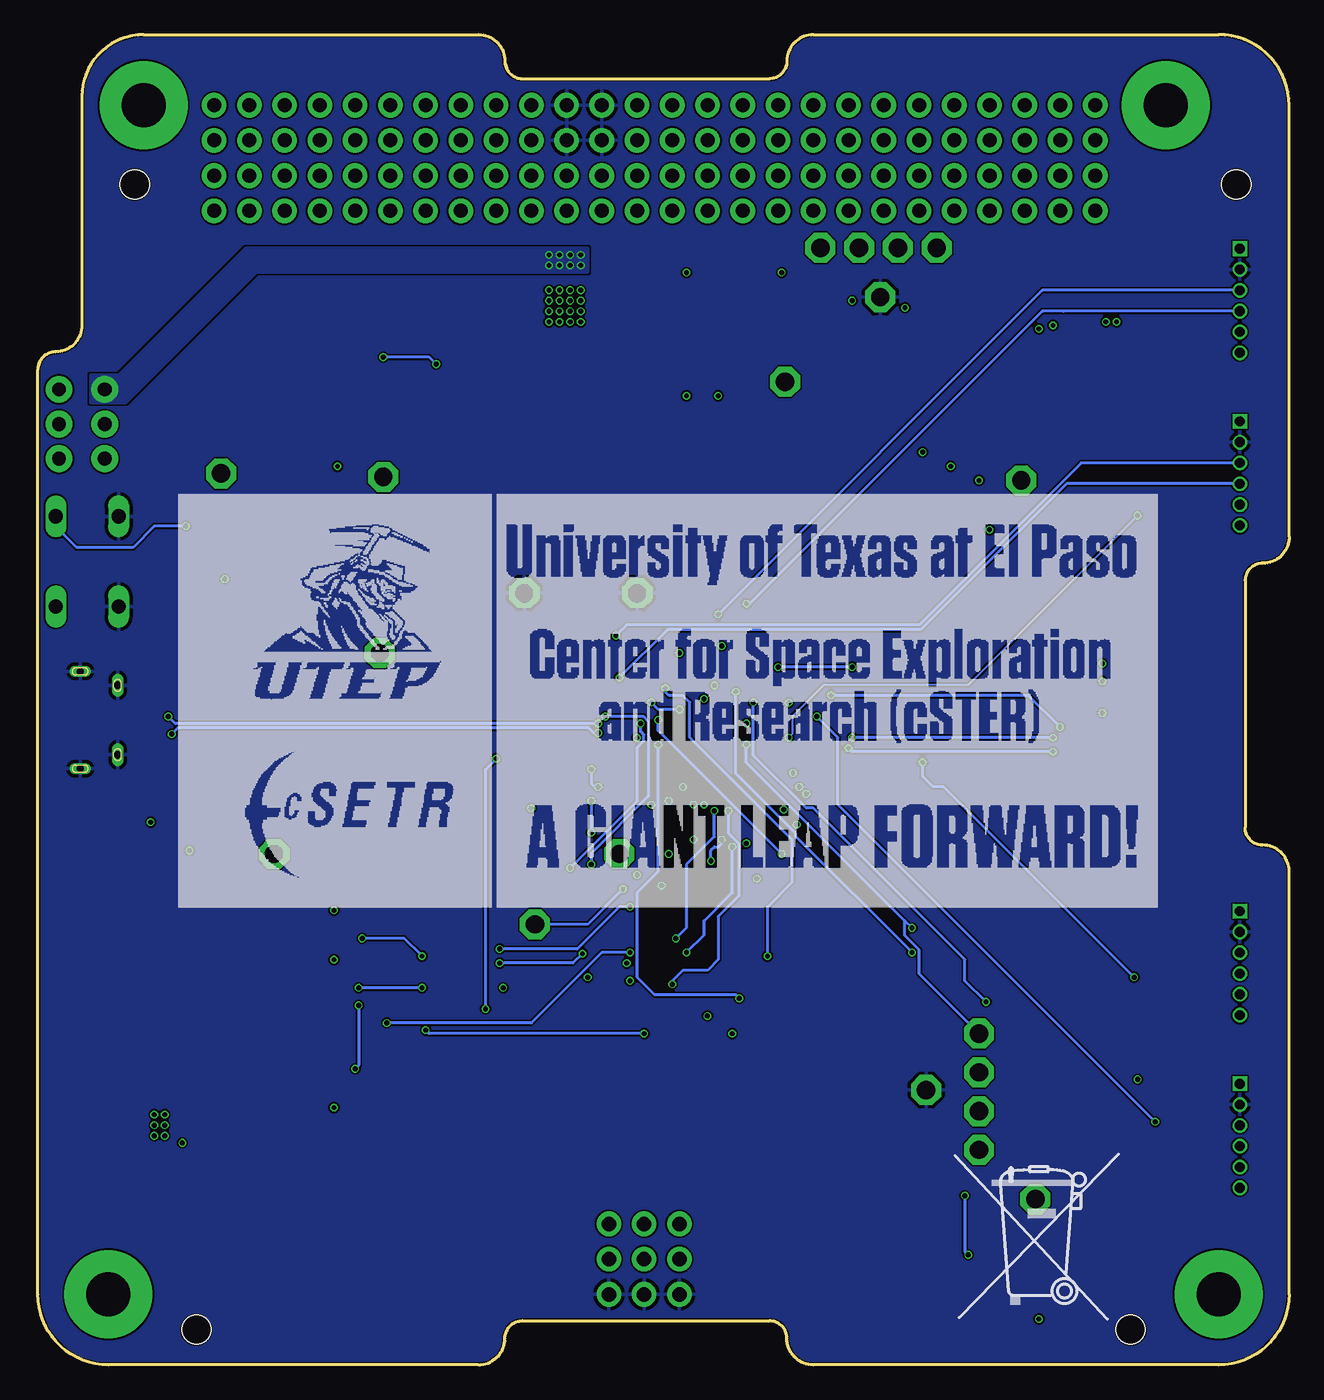
[diagram p8: board, bottom side, seen from below]

Size 90.17 x 95.89 mm. Coordinates in mm from the lower left corner, seen from the top.
Copper layers (1*2*15*16): Top 0.035559375mm / dielectric 0.17018125mm / Route2 0.01778125mm / dielectric 47mil / Route15 0.01778125mm / dielectric 0.17018125mm / Bottom 0.035559375mm
Design rules "jlcpcb4layer": minimum track width 5mil, minimum drill 0.2mm, track to track 0.126490625mm, track to pad 0.126490625mm, pad to pad 0.126490625mm, via to via 0.126490625mm, smd to smd 0mil, copper to edge 0.1mm, drill to drill 5mil, minimum pad ring 4mil, minimum via ring 4mil, stop-mask expansion 3mil, vias tented up to drill 100mil, thermal gap 10mil

### Footprints (pad centres in the part's own frame; a part is rotated, then mirrored left to right if it is on the bottom)
C0402K = smd 0.925 x 0.74: 1 -0.6,0; 2 0.6,0
C0603 = smd 1.1 x 1: 1 -0.85,0; 2 0.85,0
C1206 = smd 1.6 x 1.8: 1 -1.4,0; 2 1.4,0
CT3216 = smd 2 x 1.2: + -1.4,0; - 1.4,0
C0805 = smd 1.3 x 1.5: 1 -0.95,0; 2 0.95,0
CPDQC5V0R = smd 0.711 x 0.991: 1 0,0; 2 1.092,0
0ZCH0075AF2E = smd 0.991 x 2.794: 1 0,0; 2 2.997,0
FUSM4632X85 = smd 1.5 x 3.2: 1 -2.1,0; 2 2.1,0
3221-10-0300-00 = smd 0.66 x 2.769: 1 -2.54,-2.032; 2 -2.54,2.032; 3 -1.27,-2.032; 4 -1.27,2.032; 5 0,-2.032; 6 0,2.032; 7 1.27,-2.032; 8 1.27,2.032; 9 2.54,-2.032; 10 2.54,2.032
PC-104-PLUS = drill 1.016 pad 1.778: 1 13.97,83.185; 2 13.97,85.725; 3 16.51,83.185; 4 16.51,85.725; 5 19.05,83.185; 6 19.05,85.725; 7 21.59,83.185; 8 21.59,85.725; 9 24.13,83.185; 10 24.13,85.725; 11 26.67,83.185; 12 26.67,85.725; 13 29.21,83.185; 14 29.21,85.725; 15 31.75,83.185; 16 31.75,85.725; 17 34.29,83.185; 18 34.29,85.725; 19 36.83,83.185; 20 36.83,85.725; 21 39.37,83.185; 22 39.37,85.725; 23 41.91,83.185; 24 41.91,85.725; 25 44.45,83.185; 26 44.45,85.725; 27 46.99,83.185; 28 46.99,85.725; 29 49.53,83.185; 30 49.53,85.725; 31 52.07,83.185; 32 52.07,85.725; 33 54.61,83.185; 34 54.61,85.725; 35 57.15,83.185; 36 57.15,85.725; 37 59.69,83.185; 38 59.69,85.725; 39 62.23,83.185; 40 62.23,85.725; 41 64.77,83.185; 42 64.77,85.725; 43 67.31,83.185; 44 67.31,85.725; 45 69.85,83.185; 46 69.85,85.725; 47 72.39,83.185; 48 72.39,85.725; 49 74.93,83.185; 50 74.93,85.725; 51 77.47,83.185; 52 77.47,85.725; 53 13.97,88.265; 54 13.97,90.805; 55 16.51,88.265; 56 16.51,90.805; 57 19.05,88.265; 58 19.05,90.805; 59 21.59,88.265; 60 21.59,90.805; 61 24.13,88.265; 62 24.13,90.805; 63 26.67,88.265; 64 26.67,90.805; 65 29.21,88.265; 66 29.21,90.805; 67 31.75,88.265; 68 31.75,90.805; 69 34.29,88.265; 70 34.29,90.805; 71 36.83,88.265; 72 36.83,90.805; 73 39.37,88.265; 74 39.37,90.805; 75 41.91,88.265; 76 41.91,90.805; 77 44.45,88.265; 78 44.45,90.805; 79 46.99,88.265; 80 46.99,90.805; 81 49.53,88.265; 82 49.53,90.805; 83 52.07,88.265; 84 52.07,90.805; 85 54.61,88.265; 86 54.61,90.805; 87 57.15,88.265; 88 57.15,90.805; 89 59.69,88.265; 90 59.69,90.805; 91 62.23,88.265; 92 62.23,90.805; 93 64.77,88.265; 94 64.77,90.805; 95 67.31,88.265; 96 67.31,90.805; 97 69.85,88.265; 98 69.85,90.805; 99 72.39,88.265; 100 72.39,90.805; 101 74.93,88.265; 102 74.93,90.805; 103 77.47,88.265; 104 77.47,90.805 | drill 3.175 pad 6.35: P$1 5.08,5.08; P$2 85.09,5.08; P$3 82.55,90.805; P$4 8.89,90.805 | hole 2.108: 3.81,85.09; 83.185,85.09; 78.74,2.54; 11.43,2.54
JST_B6B-ZR(LF)(SN) = drill 0.7 square: 1 3.75,0 | drill 0.7: 2 2.25,0; 3 0.75,0; 4 -0.75,0; 5 -2.25,0; 6 -3.75,0
AMPHENOL_10118194-0001LF = smd 0.4 x 1.35: 1 -1.3,2.7; 2 -0.65,2.7; 3 0,2.7; 4 0.65,2.7; 5 1.3,2.7 | drill 0.55 pad 0.65 long: S1 -2.5,2.7; S2 2.5,2.7 | drill 0.5 pad 0.775 long: S3 -3.5,0; S6 3.5,0 | smd 1.5 x 1.55: S4 -1,0; S5 1,0
ROBOT_PORT = drill 1.041 pad 1.778: 1 -2.54,2.54; 2 -2.54,0; 3 -2.54,-2.54; 4 0,2.54; 5 0,0; 6 0,-2.54; 7 2.54,2.54; 8 2.54,0; 9 2.54,-2.54
GCT_MEM2051-00-195-00-A = smd 0.8 x 1.5: 1 1.94,-3.66; 2 0.84,-3.26; 3 -0.26,-3.66; 4 -1.36,-3.86; 5 -2.46,-3.66; 6 -3.56,-3.86; 7 -4.66,-3.66; 8 -5.76,-3.66 | smd 1 x 0.95: 9 -3.56,7.425 | smd 1.3 x 1.4: P1 -4.95,7.2; P2 0.75,7.2 | smd 1.4 x 1.9: P3 6.6,-6.95; P4 -6.55,-5.95
CDRH104RNP = smd 3.2 x 1.6: 1 0,0; 2 0,-8.9
CHIPLED_0805 = smd 1.2 x 1.2: A 0,-1.05; C 0,1.05
R0402 = smd 0.6 x 0.7: 1 -0.5,0; 2 0.5,0
R0603 = smd 1 x 1.1: 1 -0.85,0; 2 0.85,0
R1206 = smd 1.6 x 1.803: 1 -1.422,0; 2 1.422,0
B3F-10XX = drill 1.016 long: 1 -3.251,2.261; 2 3.251,2.261; 3 -3.251,-2.261; 4 3.251,-2.261
P1-13 = drill 1.321 pad 2.159 octagon: TP 0,0
PM0064A_N = smd 1.8 x 0.3: 1 -5.55,3.75; 2 -5.55,3.25; 3 -5.55,2.75; 4 -5.55,2.25; 5 -5.55,1.75; 6 -5.55,1.25; 7 -5.55,0.75; 8 -5.55,0.25; 9 -5.55,-0.25; 10 -5.55,-0.75; 11 -5.55,-1.25; 12 -5.55,-1.75; 13 -5.55,-2.25; 14 -5.55,-2.75; 15 -5.55,-3.25; 16 -5.55,-3.75; 33 5.55,-3.75; 34 5.55,-3.25; 35 5.55,-2.75; 36 5.55,-2.25; 37 5.55,-1.75; 38 5.55,-1.25; 39 5.55,-0.75; 40 5.55,-0.25; 41 5.55,0.25; 42 5.55,0.75; 43 5.55,1.25; 44 5.55,1.75; 45 5.55,2.25; 46 5.55,2.75; 47 5.55,3.25; 48 5.55,3.75 | smd 0.3 x 1.8: 17 -3.75,-5.55; 18 -3.25,-5.55; 19 -2.75,-5.55; 20 -2.25,-5.55; 21 -1.75,-5.55; 22 -1.25,-5.55; 23 -0.75,-5.55; 24 -0.25,-5.55; 25 0.25,-5.55; 26 0.75,-5.55; 27 1.25,-5.55; 28 1.75,-5.55; 29 2.25,-5.55; 30 2.75,-5.55; 31 3.25,-5.55; 32 3.75,-5.55; 49 3.75,5.55; 50 3.25,5.55; 51 2.75,5.55; 52 2.25,5.55; 53 1.75,5.55; 54 1.25,5.55; 55 0.75,5.55; 56 0.25,5.55; 57 -0.25,5.55; 58 -0.75,5.55; 59 -1.25,5.55; 60 -1.75,5.55; 61 -2.25,5.55; 62 -2.75,5.55; 63 -3.25,5.55; 64 -3.75,5.55
SOP65P640X120-16N = smd 1.57 x 0.41: 1 -2.87,2.275; 2 -2.87,1.625; 3 -2.87,0.975; 4 -2.87,0.325; 5 -2.87,-0.325; 6 -2.87,-0.975; 7 -2.87,-1.625; 8 -2.87,-2.275; 9 2.87,-2.275; 10 2.87,-1.625; 11 2.87,-0.975; 12 2.87,-0.325; 13 2.87,0.325; 14 2.87,0.975; 15 2.87,1.625; 16 2.87,2.275
SOT95P280X145-5N = smd 1.21 x 0.59: 1 -1.255,0.95; 2 -1.255,0; 3 -1.255,-0.95; 4 1.255,-0.95; 5 1.255,0.95
SOP50P310X90-8N = smd 1.12 x 0.27: 1 -1.405,0.75; 2 -1.405,0.25; 3 -1.405,-0.25; 4 -1.405,-0.75; 5 1.405,-0.75; 6 1.405,-0.25; 7 1.405,0.25; 8 1.405,0.75
RT8293B = smd 1.27 x 0.635: 1 0,0; 2 0,-1.27; 3 0,-2.54; 4 0,-3.81; 5 4.724,-3.81; 6 4.724,-2.54; 7 4.724,-1.27; 8 4.724,0 | smd 2.007 x 2.311: 9 2.362,-1.905
JS202011CQN = drill 1 pad 1.93: 1 -2.5,0; 2 0,0; 3 2.5,0; 4 -2.5,3.3; 5 0,3.3; 6 2.5,3.3
XTAL_ECS-160-9-42-CKM-TR = smd 1.4 x 1.15: 1 -1.5,-0.8; 2 1.5,-0.8; 3 1.5,0.8; 4 -1.5,0.8
RT3215-32.768-12.5-TR = smd 1.016 x 1.778: 1 0,0; 2 2.54,0

### Placement (x,y rotation side)
C1  54.61,40.89 0 top
C2  33.78,43.18 180 top
C3  33.78,41.91 180 top
C4  42.67,36.07 270 top
C5  43.94,36.07 270 top
C6  54.61,42.16 0 top
C7  44.45,52.83 90 top
C8  40.89,36.07 270 top
C9  42.93,52.83 90 top
C10  39.37,36.07 270 top
C11  51.82,43.43 180 top
C12  51.82,37.85 0 top
C13  77.47,60.45 180 top
C14  52.32,45.21 0 top
C15  51.82,52.32 0 top
C16  74.42,45.72 180 top
C17  60.96,78.99 180 top
C18  60.96,75.95 180 top
C19  78.74,49.28 90 top
C20  14.48,77.72 180 top
C21  19.3,76.96 270 top
C22  10.16,73.15 270 top
C23  14.22,30.99 180 top
C24  18.8,30.23 270 top
C25  9.65,26.67 270 top
C26  70.87,49.28 90 top
C27  74.68,52.58 0 top
C28  55.88,27.69 270 top
C29  71.88,74.17 90 top
C30  48.51,28.96 90 top
C31  65.28,74.68 270 top
C32  83.31,17.02 270 top
C33  85.6,17.02 270 top
C34  46.48,70.61 90 top
C35  49.28,70.61 90 top
C36  74.93,72.64 0 top
C37  74.93,69.6 0 top
C38  47.75,26.16 90 top
C39  41.15,25.15 270 top
C40  77.72,78.23 270 top
D1  41.91,12.95 270 top
D2  52.58,12.95 270 top
D3  51.05,12.95 270 top
D4  72.14,28.19 270 top
D5  72.14,32 270 top
D6  72.14,19.81 90 top
D7  72.14,23.37 90 top
D8  82.3,44.45 90 top
D9  82.3,47.75 270 top
F1  69.85,78.99 180 top
F2  75.18,40.64 0 top
J1  21.59,4.06 0 top
J2  0,0 0 top
J3  3.56,76.71 90 top
J4  3.56,64.26 90 top
J5  3.56,16.51 90 top
J6  3.56,28.96 90 top
J7  87.12,46.48 90 top
J8  46.48,7.62 0 top
J9  81.79,26.92 90 top
L1  60.96,68.33 270 top
LED1  87.88,39.12 270 top
LED2  5.33,50.29 90 top
LED3  5.33,48.51 90 top
LED4  5.33,46.48 90 top
LED5  5.59,56.13 90 top
R1  46.23,36.07 90 top
R2  77.47,57.91 0 top
R3  13.21,63.5 90 top
R4  16.26,63.5 90 top
R5  12.7,17.02 90 top
R6  15.75,17.02 90 top
R7  49.78,28.96 90 top
R8  73.41,67.06 0 top
R9  72.9,64.01 90 top
R10  40.13,25.15 270 top
R11  9.4,56.13 180 top
R12  44.7,21.08 90 top
R13  84.07,39.12 0 top
R14  70.1,27.94 90 top
R15  70.1,31.75 90 top
R16  80.01,35.81 180 top
R17  78.49,17.02 270 top
R18  70.1,20.07 270 top
R19  42.16,80.01 0 top
R20  9.14,51.05 0 top
R21  9.14,48.51 0 top
R22  9.14,45.97 0 top
R23  74.17,78.23 270 top
R24  37.59,80.01 180 top
R25  46.99,21.08 90 top
R26  49.28,21.08 90 top
R27  78.23,71.12 270 top
S1  86.61,57.91 270 top
TP1  73.15,36.83 0 top
TP2  65.53,51.31 0 top
TP3  76.96,64.26 0 top
TP4  36.32,70.87 0 top
TP5  65.28,64.01 0 top
TP7  30.99,80.52 180 top
TP8  33.78,80.52 180 top
TP9  25.4,80.52 180 top
TP10  28.19,80.52 180 top
TP11  22.35,15.49 90 top
TP12  22.35,18.29 90 top
TP13  22.35,21.08 90 top
TP14  22.35,23.88 90 top
TP15  26.16,19.81 90 top
TP16  29.46,76.96 0 top
TP17  48.26,36.83 0 top
TP18  54.36,31.75 0 top
TP19  46.99,55.63 90 top
TP20  55.12,55.63 90 top
TP21  18.29,11.94 0 top
TP22  19.3,63.75 0 top
U1  42.67,44.45 0 top
U2  14.73,70.87 90 top
U3  14.22,24.64 90 top
U4  74.68,49.28 180 top
U5  52.83,26.67 180 top
U6  44.2,26.67 180 top
U12  65.79,70.87 0 top
U$1  88.65,67.82 90 top
U$4  [CSTER]  30.99,8.89 90 top
U$5  [UTEP_LOGO]  64.52,8.89 0 top
U$7  [CSTER_UTEP_LOGO]  80.01,33.02 0 bottom
U$8  [MUELLTONNE]  24.89,2.79 0 bottom
U$10  [GND]  27.69,19.81 90 top
U$11  [GND]  29.46,75.44 0 top
U$13  [GND]  55.12,54.1 0 top
U$14  [GND]  46.99,54.1 0 top
Y1  51.82,49.02 90 top
Y2  51.82,41.91 270 top

### Tracks (layer width: path | path; a pad name or v marks a point on that pad's centre or on a via)
!HIB
  Top 0.203: TP17.TP 48.22,36.87 U1.33
!RST  (via drill 0.35)
  Top 0.203: S1.2 S1.1 | U1.38 48.24,43.18 49.28,43.18 50.55,44.45 54.61,44.45 | 54.61,44.45 66.04,55.88 77.47,55.88 78.32,56.73 R2.2 C13.1 v79.5,60.45 | v57.15,43.69 56.39,44.45 54.61,44.45 | J1.10 26.42,3.81 51.31,3.81 61.72,14.22 61.72,22.1 58.83,25 58.27,25 57.91,25.35 v57.91,25.65
  Bottom 0.203: v57.91,25.65 57.91,42.93 v57.15,43.69 | v79.5,60.45 81.79,60.45 83.31,58.93 87.38,58.93 88.88,60.43 S1.1
!SS  (via drill 0.35)
  Top 0.203: v40.42,39.93 U1.20 | U1.20 | J9.2 81.2,27.76 78.05,30.91 D5.2 70.12,30.91 R15.1 66.97,30.9 v66.8,30.73 | v44.45,27.43 44.45,26.07 44.97,25.56 45.05,25.56 46.48,24.13 v46.48,23.88 | v62.23,24.13 63.25,25.15 63.25,28.19 62.48,28.96 v62.48,29.46
  Bottom 0.203: v40.42,39.93 40.39,39.9 40.39,38.31 39.63,37.55 39.63,33.83 41.15,32.31 41.15,29.21 41.91,28.45 43.69,28.45 44.45,27.69 v44.45,27.43 | v62.48,29.46 63.75,30.73 v66.8,30.73 | v46.48,23.88 61.98,23.88 v62.23,24.13
+3V3  (via drill 0.35)
  Top 0.203: R2.1 76.62,56.73 v76.71,56.64 | U1.26 43.42,37.86 43.94,37.34 C5.1 | C4.1 C5.1 | U1.11 37.1,43.18 C2.1 C3.1 34.8,41.49 v34.8,41.15 | U1.37 49.56,42.7 49.79,42.93 49.79,43.16 50.66,44.03 52.97,44.03 53.11,43.9 53.11,43.07 C6.1 C1.1 54.61,40.29 v54.61,40.12 | U1.42 v47,45.2 | U1.54 43.92,51.29 v43.94,51.31 | C5.1 44.1,36.83 v44.7,36.83 | R1.1 46.73,35.57 v46.99,35.31 | R24.2 36.74,78.91 v36.58,78.74 | R19.2 43.43,79.59 v43.43,78.74 | U1.2 36.12,47.7 36.07,47.75 36.06,47.75 v36.06,47.73 | R15.2 69,32.6 v68.83,32.77 | R14.2 69.25,28.79 v68.83,29.21 | R18.2 69.51,19.22 v68.83,18.54 | R16.2 79.16,37 v79.25,37.08 | R17.2 79.59,16.17 v79.76,16 | J1.1 19.05,2.29 v18.03,3.3 | U5.3 55.71,26.92 C28.2 55.97,27.18 v56.64,27.18 | R10.2 v40.13,23.88 | U6.3 47.59,26.92 C38.2 47.5,27.02 v47.5,27.69 | R7.2 50.55,28.69 v50.55,27.94
  Top 0.406: J9.4 86.02,25.19 86.33,25.19 89.15,22.37 89.15,18.8 88.23,17.87 C33.1 C32.1
  other vias: 81.03,18.03 81.79,18.03 81.03,17.27 81.79,17.27 81.03,16.51 81.79,16.51
  pour Route2 (rank 2): 0,0 90.17,0 90.17,5.08 90.17,96.01 82.8,96.01 0,96.01
  pour Top (no thermals): 80.52,18.54 80.52,16 82.3,16 82.3,17.27 83.82,17.27 83.82,18.54
+3V3_EPS  (via drill 0.35)
  other vias: 51.05,80.01 51.82,80.01 52.58,80.01 53.34,80.01 51.05,79.25 51.82,79.25 52.58,79.25 53.34,79.25
  pour Top (no thermals): 45.97,91.95 48.26,91.95 48.26,81.79 49.53,80.52 53.85,80.52 53.85,78.74 48.51,78.74 45.97,81.28
  pour Bottom (no thermals): 50.55,80.52 50.55,78.74 74.42,78.74 82.8,70.36 83.06,70.1 83.82,69.34 86.36,69.34 86.36,71.37 84.33,71.37 75.18,80.52
+3V3_REG
  Top 0.203: U4.5 73.32,48.43 C26.1 68.41,48.43 TP2.TP
  pour Top (no thermals): 67.06,50.8 67.06,47.5 74.17,47.5 74.17,49.53 72.64,49.53 72.39,49.28 69.34,49.28 69.34,50.8
  pour Top (no thermals): 67.06,50.8 67.06,47.5 69.34,47.5 69.34,50.29 72.9,53.85 80.01,53.85 81.03,54.86 81.03,62.23 83.06,64.26 86.36,64.26 86.36,66.55 84.07,66.55 80.01,62.48 80.01,55.88 78.99,54.86 71.63,54.86 67.56,50.8
+5V  (via drill 0.35)
  Top 0.203: R13.1 v82.04,39.12 | U5.7 49.78,26.42 48.51,27.69 C30.1 48.35,28.36 47.75,28.96 v47.74,28.96 | U6.7 41.82,26.42 C39.1 41.56,25.75 41.91,25.4 v41.91,25.15 v41.92,25.15
  pour Route15 (rank 2): 0,96.01 90.17,96.01 90.17,95 90.17,0 88.14,0 0,0 0,0.25
+5V_EPS  (via drill 0.35)
  other vias: 51.05,77.47 51.82,77.47 52.58,77.47 53.34,77.47 51.05,76.71 51.82,76.71 52.58,76.71 53.34,76.71 51.05,75.95 51.82,75.95 52.58,75.95 53.34,75.95 51.05,75.18 51.82,75.18 52.58,75.18 53.34,75.18
  pour Top (no thermals): 43.18,91.95 45.47,91.95 45.47,80.77 48.26,77.98 53.85,77.98 53.85,74.68 45.21,74.68 43.94,75.95 43.94,81.79 43.18,82.55
  pour Route2: 50.55,77.98 50.55,74.68 53.85,74.68 83.31,74.68 87.12,70.87 87.12,69.09 89.92,69.09 89.92,71.88 89.15,72.64 87.88,72.64 82.55,77.98
+5V_USB
  Top 0.203: TP1.TP 73.15,40.57 F2.1
  pour Top (no thermals): 71.88,42.67 71.88,38.86 74.17,38.86 74.17,41.4 76.71,43.94 76.71,47.75 79.25,47.75 79.25,49.28 77.98,49.28 77.98,48.77 75.18,48.77 75.18,49.78 76.71,49.78 76.71,50.55 74.93,50.55 74.68,50.29 74.68,48.51 74.93,48.26 74.93,43.69 73.91,42.67
  pour Top (no thermals): 77.72,49.28 77.72,47.75 79.5,47.75 83.57,51.82 83.57,60.96 84.84,62.23 88.14,62.23 89.66,63.75 89.66,66.55 87.63,66.55 87.63,64.01 86.87,63.25 83.31,63.25 82.55,62.48 82.55,53.85 79.76,51.05 79.76,49.28
+6V
  Top 0.203: L1.2 59.43,60.96 73.66,60.96 74.93,62.23 74.93,66.38 R8.2 | R11.1 18.8,47.59 C24.1 | C34.1 45.09,67.82 39.37,67.82 TP4.TP
  pour Top (no thermals): 55.37,70.87 45.21,70.87 45.21,65.53 55.37,65.53
  pour Top (no thermals): 45.21,70.87 47.75,70.87 47.75,65.53 33.02,65.53 24.64,57.15 24.64,35.31 19.56,30.23 16,30.23 14.73,28.96 14.73,26.67 14.48,26.67 14.48,31.75 22.35,39.62 22.35,59.18 29.21,66.04 29.21,69.6 21.84,76.96 16,76.96 15.24,76.2 15.24,72.9 14.99,72.9 14.99,76.45 14.73,76.71 14.73,78.49 15.24,78.99 22.35,78.99 32.26,69.09 43.94,69.09 45.21,70.36
+VBAT_EPS
  pour Top (no thermals): 68.58,91.69 68.58,77.22 71.12,77.22 71.12,91.69
GND
  Top 0.203: J7.5 84.39,47.75
  pour Top (rank 2): 0,96.01 0,0 90.17,0 90.17,96.01
  pour Bottom (rank 2): 0,96.01 90.17,96.01 90.17,0 0,0
GNDX  (via drill 0.35)
  Top 0.203: C11.2 50.55,43.43 50.29,43.18 v50.29,42.93 | U1.35 48.27,41.66 v49.78,41.66 50.29,41.15 v50.29,40.64 | v50.29,38.35 50.8,37.85 C12.1
  Bottom 0.203: v50.29,42.93 50.29,41.91 50.04,41.66 v49.78,41.66 | v50.29,40.64 v50.29,38.35
M0_CHA  (via drill 0.35)
  Top 0.203: v48.51,52.58 49.78,51.31 49.78,48.01 49.48,47.7 U1.47
  Bottom 0.203: J4.3 15,65.01 26.67,53.34 47.75,53.34 v48.51,52.58
M0_CHB  (via drill 0.35)
  Top 0.203: v48.26,49.53 48.26,48.24 U1.48
  Bottom 0.203: J4.4 16.03,63.51 26.53,53.01 44.78,53.01 v48.26,49.53
M0_IN1  (via drill 0.35)
  Top 0.203: v21.59,60.2 21.59,65.53 15.24,71.88 14.22,71.88 13.79,72.31 13.25,72.31 12.46,73.1 U2.16 12.45,73.75 v12.45,75.18 | v35.48,38.94 35.92,39.38 35.92,40.78 36.22,41.08 37,41.08 U1.15
  Route2 0.203: v12.45,75.18 16.26,78.99 29.46,78.99 TP7.TP
  Route15 0.203: v21.59,60.2 29.46,52.32 29.46,39.62 30.48,38.61 35.31,38.61 35.48,38.78 v35.48,38.94
M0_IN2  (via drill 0.35)
  Top 0.203: v22.35,63.75 22.35,65.53 15.24,72.64 13.57,72.64 13.32,72.89 13.32,73.52 U2.15 13.21,73.84 v13.21,75.18 | v36.42,40.03 37.1,40.7 U1.16
  Route2 0.203: v13.21,75.18 15.24,77.22 27.43,77.22 28.7,78.49 32,78.49 33.78,80.26 TP8.TP
  Route15 0.203: v22.35,63.75 30.99,55.12 30.99,41.4 32.77,39.62 36.07,39.62 36.42,39.98 v36.42,40.03
M0_OUT1
  Top 0.406: U2.2 13.11,69.19 12.7,69.6 5.14,69.6 J4.1
M0_OUT2
  Top 0.406: U2.4 14.41,66.62 14.73,66.29 14.73,60.71 13.97,59.94 4.12,59.94 J4.6
M1_CHA  (via drill 0.35)
  Top 0.203: v41.15,54.1 41.92,53.33 U1.58
  Bottom 0.203: J3.3 17.79,77.46 v41.15,54.1
M1_CHB  (via drill 0.35)
  Top 0.203: v39.12,54.86 41.66,54.86 42.33,54.19 42.33,51.67 42.42,51.58 U1.57
  Bottom 0.203: J3.4 16.24,75.96 16.26,75.95 17.78,75.95 38.86,54.86 v39.12,54.86
M1_IN1  (via drill 0.35)
  Top 0.203: v26.42,65.79 18.47,73.74 U2.9 17.09,73.74 v18.03,74.68 | v35.76,42.67 36.22,42.2 U1.13 | v31.5,76.71 30.77,77.43 30.77,77.5 29.5,78.77 29.5,81.06 28.74,81.83 27.65,81.83 26.34,80.52 TP9.TP
  Route2 0.203: v18.03,74.68 29.97,74.68 31.5,76.2 v31.5,76.71
  Route15 0.203: v26.42,65.79 35.31,56.89 35.31,52.12 35.56,51.86 35.56,42.67 v35.76,42.67
M1_IN2  (via drill 0.35)
  Top 0.203: v24.38,64.77 23.88,64.77 16.36,72.29 U2.10 16.36,74.52 16.76,74.93 v17.02,74.93 | v35.31,41.66 37.08,41.66 U1.14 | v27.69,76.2 27.69,80.01 TP10.TP
  Route2 0.203: v17.02,74.93 18.29,76.2 v27.69,76.2
  Route15 0.203: v24.38,64.77 34.98,54.17 34.98,42.73 35.31,42.41 v35.31,41.66
M1_OUT1
  Top 0.406: U2.7 16.36,69.5 14.48,71.37 9.14,71.37 7.11,73.41 7.11,76.9 J3.1
M1_OUT2
  Top 0.406: U2.5 15.06,69.27 13.72,70.61 5.9,70.61 J3.6
M01_SLEEP  (via drill 0.35)
  Top 0.152: U2.1 10.92,66.46 v10.92,61.21 | v36.07,45.21 37.11,45.21 U1.7
  Bottom 0.152: v10.92,61.21 23.11,49.02 33.53,49.02 35.81,46.74 35.81,45.47 v36.07,45.21
M2_CHA  (via drill 0.35)
  Top 0.203: J5.3 0.51,20.31 0.51,34.54 11.94,45.97 v16.51,45.97 | v33.02,48.26 37.06,48.26 U1.1
  Bottom 0.203: v16.51,45.97 18.8,48.26 v33.02,48.26
M2_CHB  (via drill 0.35)
  Top 0.203: J5.4 7.89,15.76 v9.65,17.53 | v34.04,46.74 37.09,46.74 U1.4
  Bottom 0.203: v9.65,17.53 32.51,40.39 32.51,45.21 v34.04,46.74
M2_IN1  (via drill 0.35)
  Top 0.203: v11.18,27.94 11.61,27.51 U3.16 11.95,26.15 12.7,25.4 14.99,25.4 18.03,22.35 18.03,16.76 19.3,15.49 TP11.TP | v26.42,43.43 26.42,45.21 v31.5,50.29 | v36.83,50.29 38.63,50.29 U1.64
  Bottom 0.203: v26.42,43.43 26.42,42.42 25.65,41.66 24.89,41.66 v11.18,27.94 | v31.5,50.29 v36.83,50.29
M2_IN2  (via drill 0.35)
  Top 0.203: U3.15 12.82,27.29 12.82,26.66 13.31,26.16 19.05,26.16 | v38.61,47.75 38.61,48.01 39.42,48.82 U1.63 | 19.05,26.16 v21.84,26.16 | 19.05,26.16 19.05,21.59 TP12.TP
  Bottom 0.203: v21.84,26.16 23.37,27.69 23.37,29.21 34.29,40.13 34.8,40.13 38.61,43.94 v38.61,47.75
M2_OUT1
  Top 0.406: U3.2 12.6,22.71 11.94,23.37 8.89,23.37 5.78,20.26 J5.1
M2_OUT2
  Top 0.406: U3.4 13.9,20.64 14.22,20.32 14.22,13.46 13.21,12.45 3.87,12.45 J5.6
M3_CHA  (via drill 0.35)
  Top 0.203: J6.3 2.03,31.23 2.03,33.02 13.21,44.2 v17.02,44.2 | v31.75,44.45 35.31,44.45 35.56,44.2 U1.9
  Bottom 0.203: v17.02,44.2 31.5,44.2 v31.75,44.45
M3_CHB  (via drill 0.35)
  Top 0.203: J6.4 1.02,30.75 1.02,33.78 12.45,45.21 v17.02,45.21 | v31.5,45.21 35.31,45.21 35.82,44.7 U1.8
  Bottom 0.203: v17.02,45.21 v31.5,45.21
M3_IN1  (via drill 0.35)
  Top 0.203: U3.9 24.13,27.51 | 24.13,27.51 24.97,27.51 v27.18,29.72 | v39.88,48.51 39.88,49.96 U1.62 | 24.13,27.51 24.13,22.86 TP13.TP
  Bottom 0.203: v27.18,29.72 35.56,38.1 35.56,38.31 39.88,42.62 v39.88,48.51
M3_IN2  (via drill 0.35)
  Top 0.203: U3.10 15.85,28.55 16,28.7 16.76,28.7 17.27,28.19 23.88,28.19 v27.18,31.5 | v39.12,44.7 40.42,46.01 U1.61
  Bottom 0.203: v27.18,31.5 27.69,32 | 27.69,32 39.12,43.43 v39.12,44.7 | 27.69,32 27.69,30.94 26.67,29.93 26.67,28.2 TP14.TP
M3_OUT1
  Top 0.406: U3.7 15.73,21.88 15.73,22.66 13.5,24.89 8.64,24.89 7.11,26.42 7.11,30.99 5.33,32.77 3.62,32.77 J6.1
M3_OUT2
  Top 0.406: U3.5 14.43,21.88 14.43,22.66 12.96,24.13 4.63,24.13 J6.6
M23_SLEEP  (via drill 0.35)
  Top 0.152: U3.1 11.95,21.6 v10.92,20.57 | v39.11,46.23 38.86,46.23 38.33,45.7 U1.6
  Route15 0.152: v10.92,20.57 9.4,20.57 9.14,20.83 9.14,22.86 24.59,38.3 35.52,38.3 36.9,39.69 36.9,39.7 39.59,42.39 39.59,44.9 39.37,45.13 39.37,45.97 v39.11,46.23
N$1
  Top 0.203: U1.36 51.53,42.2 Y2.1 52.42,42.51 C11.1
N$2
  Top 0.203: U1.40 49.62,44.2 50.78,45.36 50.78,45.68 Y1.1 52.62,46.27 51.72,45.37 C14.1
N$3
  Top 0.203: U1.34 49.48,41.2 49.78,40.89 49.78,39.88 50.29,39.37 Y2.2 52.42,38.77 C12.2
N$4  (via drill 0.35)
  Top 0.203: U1.32 46.42,36.76 R1.2 46.49,36.57 48.01,35.05 v48.01,34.29
  Bottom 0.203: v48.01,34.29 50.55,31.75 TP18.TP
N$5  (via drill 0.35)
  Top 0.203: C7.1 C9.1 U1.56 42.92,48.76 v42.16,48.01 | v42.93,37.85 U1.25 | C10.1 C8.1 41.59,37.36 42.69,37.36 42.93,37.59 42.93,37.85 v42.93,37.85 | v42.92,37.86 v42.93,37.85
  Route2 0.203: v42.16,48.01 42.16,46.48 45.21,43.44 45.21,40.43 44.91,40.13 43.44,40.13 42.92,39.62 v42.92,37.86
N$6
  Top 0.203: C15.1 51.02,52.12 Y1.3 51.02,49.12 50.21,48.32 50.21,46.73 50.29,46.65 50.29,45.72 50.29,45.34 49.65,44.7 U1.41
N$7
  pour Top (no thermals): 85.09,45.47 83.57,45.47 83.06,44.96 83.06,42.42 82.04,41.4 78.49,41.4 78.49,42.67 76.2,42.67 76.2,38.61 78.49,38.61 78.49,40.13 82.04,40.13 83.57,41.66 83.57,44.96 85.09,44.96
N$8
  pour Top: 13.59,68.71 13.59,67.18 12.19,65.79 12.19,64.01 14.22,64.01 14.22,66.04 13.97,66.29 13.97,68.71
N$9
  pour Top: 15.24,66.04 15.24,64.01 17.27,64.01 17.27,66.04 17.02,66.29 16.26,66.29 15.88,67.69 15.88,68.83 15.49,68.83 15.49,66.29
N$10
  Top 0.406: U2.11 15.71,75.65 16.26,76.2 19.12,76.2 C21.2
N$11
  Top 0.203: C31.1 66.8,74 66.8,71.88 U12.1
N$12
  Top 0.203: C22.1 10.16,75.18 10.92,75.95 13.21,75.95 13.76,75.4 U2.14
N$13
  pour Top (no thermals): 13.08,22.48 13.08,20.7 12.45,20.07 11.68,20.07 11.68,17.53 13.72,17.53 13.72,20.07 13.46,20.32 13.46,22.48
N$14
  pour Top (no thermals): 14.99,22.61 14.99,20.57 14.73,20.32 14.73,17.53 16.76,17.53 16.76,19.56 16.26,19.56 15.37,20.45 15.37,22.61
N$15
  Top 0.406: U3.11 15.2,28.66 15.81,29.28 C24.2
N$16
  Top 0.203: U3.8 17.27,21 17.27,12.95 TP21.TP
N$17
  Top 0.203: C25.1 11.09,28.96 12.7,28.96 13.25,28.41 U3.14
N$18
  Top 0.203: U2.8 19.3,65.7 TP22.TP
N$19
  Top 0.203: U5.6 50.55,26.92 49.78,27.69 R7.1
N$20
  Top 0.203: U4.4 73.83,50.63 C27.1
N$21
  Top 0.203: U12.8 71.88,72.24 C29.1
N$22
  Top 0.203: R13.2 LED1.A
N$23
  Top 0.203: R26.1 49.02,19.98 J8.7 49.35,10.16 D3.2
N$24
  Top 0.203: LED2.A 7.15,51.05 R20.1
N$25
  Top 0.203: J9.8 81.78,21.16 R17.1
N$26
  Top 0.203: J9.1 85.45,31.23 R16.1
N$27
  Top 0.203: R25.1 46.48,19.72 J8.4 46.48,9.91 47.5,8.89 49.61,8.89 D2.2
N$28
  Top 0.203: LED3.A R21.1
N$30
  Top 0.203: R10.1 40.13,26.42 40.64,26.92 U6.6
N$31
  Top 0.203: R12.1 44.7,10.92 J8.1 42.24,11.86 D1.2
N$32
  Top 0.203: LED5.A R11.2
N$34
  Top 0.203: LED4.A 6.89,45.97 R22.1
N$35  (via drill 0.35)
  Top 0.203: L1.1 60.96,71.63 v61.47,72.14 | v65.28,72.64 C31.2
  Bottom 0.203: v61.47,72.14 61.98,72.64 v65.28,72.64
  pour Top (no thermals): 66.55,68.83 66.55,67.82 62.48,67.82 62.48,65.53 57.66,65.53 57.66,70.87 62.48,70.87 62.48,68.83
N$36
  Top 0.203: R9.2 72.56,65.2 R8.1 U12.5 71.23,67.78 71.24,67.78 71.78,68.33 74.68,68.33 76.96,66.04 TP3.TP
N$38  (via drill 0.35)
  Top 0.203: R20.2 10.5,50.55 v13.46,50.55 | U1.28 44.42,40.21 44.2,40.43 44.2,41.15 v43.69,41.66
  Route2 0.203: v13.46,50.55 21.84,42.16 43.18,42.16 v43.69,41.66
N$39  (via drill 0.35)
  Top 0.203: R21.2 10.76,49.28 v13.46,49.28 | v44.7,40.64 44.92,40.42 U1.29
  Route2 0.203: v13.46,49.28 15.75,46.99 15.75,44.75 19.86,40.64 35.01,40.64 35.26,40.89 44.45,40.89 v44.7,40.64
N$40  (via drill 0.35)
  Top 0.203: R22.2 11.01,46.99 v13.46,46.99 | v45.21,34.54 45.42,34.75 U1.30
  Route2 0.203: v13.46,46.99 14.22,46.23 14.22,44.2 25.15,33.27 44.2,33.27 45.21,34.29 v45.21,34.54
N$41
  Top 0.203: U12.6 70.76,68.33 72.03,69.6 C37.1 C36.1
N$42
  Top 0.203: C36.2 77.56,72.64 R27.1
N$43
  Top 0.203: F1.2 66.85,76.91 67.31,76.45 71.88,76.45 72.14,76.71 72.14,78.23 72.99,79.08 R23.1 | U12.2 66.29,69.6 66.8,69.09 66.8,65.28 65.53,64.01 TP5.TP
  pour Top (no thermals): 68.07,81.03 68.07,77.22 64.14,77.22 64.14,70.23 66.55,70.23 66.55,69.22 62.87,69.22 62.87,72.26 60.96,74.17 60.96,80.52 61.47,81.03
OBC_CAN+  (via drill 0.35)
  Top 0.203: v41.42,48.97 U1.59
  Route15 0.203: J2.1 40.31,56.84 40.31,51.68 41.4,50.59 41.4,48.99 v41.42,48.97
OBC_CAN-  (via drill 0.35)
  Top 0.203: v40.89,51.82 40.92,51.79 U1.60
  Route15 0.203: v40.89,51.82 40.89,53.64 40.64,53.89 40.64,59.05 J2.3
OBC_RX  (via drill 0.35)
  Top 0.203: v38.35,35.05 38.35,37.38 38.37,37.39 38.37,38.34 U1.17
  Route15 0.203: v38.35,35.05 38.35,34.8 39.62,33.53 57.41,33.53 63.75,39.88 63.75,84.2 J2.40
OBC_SCL  (via drill 0.35)
  Top 0.203: J2.21 38.44,82.26 R24.1 38.44,72.56 v41.15,69.85 | U1.23 41.92,39.72 41.93,39.72 41.93,40.15 v42.16,40.39
  Route15 0.203: v41.15,69.85 41.15,61.47 42.93,59.69 42.93,41.15 v42.16,40.39
OBC_SDA  (via drill 0.35)
  Top 0.203: J2.23 41.31,82.59 R19.1 42.93,78.4 42.93,70.36 v43.43,69.85 | v42.93,40.39 42.42,39.88 U1.24
  Route15 0.203: v43.43,69.85 43.43,60.71 44.45,59.69 44.45,41.66 43.18,40.39 v42.93,40.39
OBC_TX  (via drill 0.35)
  Top 0.203: v39.12,37.59 39.42,37.9 U1.18
  Route15 0.203: v39.12,37.59 39.12,37.34 41.41,35.05 45.42,35.05 45.67,34.8 53.09,34.8 60.96,42.67 60.96,72.34 61.21,72.6 61.21,82.17 J2.39
PPM
  Top 0.203: U1.53 44.42,45.44 43.69,44.7 42.42,44.7 39.12,41.4 39.12,40.38 38.04,39.3 38.04,37.53 38.02,37.52 38.02,36.75 37.59,36.32 37.59,34.29 42.67,29.21 42.67,27.98 42.79,27.87 U6.5
PPM_IN
  Top 0.203: U6.8 42.79,23.84 R12.2
SD_MISO  (via drill 0.35)
  Top 0.203: v41.67,36.32 41.66,36.32 41.66,33.78 42.67,32.77 47.24,32.77 v47.5,33.02 | v40.9,37.84 40.9,38.88 U1.21 | J9.7 79.92,22.26 78.49,20.83 72.21,20.83 D6.2 70.12,20.9 | 70.12,20.9 R18.1 | v67.06,25.91 67.06,26.16 63.25,29.97 v56.9,29.97 | v67.31,21.34 67.74,20.9 70.12,20.9
  Bottom 0.203: v41.67,36.32 41.67,37.07 41.4,37.34 41.15,37.34 40.89,37.59 v40.89,37.84 v40.9,37.84 | v67.06,25.91 67.06,21.59 v67.31,21.34 | v47.5,33.02 48.26,33.02 51.31,29.97 v56.9,29.97
SD_MOSI  (via drill 0.35)
  Top 0.203: v41.42,39.93 U1.22 | J9.3 73.16,26.66 72.72,27.1 D4.2 70.12,27.1 R14.1 70.02,27.18 v67.06,27.18 | v44.2,30.73 49.78,30.73 50.87,29.64 v50.92,29.64 | v56.9,28.96 58.67,27.18 v62.48,27.18
  Bottom 0.203: v41.42,39.93 41.42,38.08 43.43,36.07 43.43,31.5 v44.2,30.73 | v62.48,27.18 v67.06,27.18 | v50.92,29.64 51.61,28.96 v56.9,28.96
SD_SCK  (via drill 0.35)
  Top 0.203: v40.13,37.34 39.92,37.55 U1.19 | J9.5 D7.2 65.96,24.46 65.79,24.64 v65.02,24.64 | v43.43,29.72 v47.5,29.72
  Bottom 0.203: v40.13,37.34 40.13,34.04 42.16,32 42.16,30.99 v43.43,29.72 | v47.5,29.72 49.53,29.72 54.61,24.64 v65.02,24.64
SERVO_0  (via drill 0.35)
  Top 0.203: v49.29,46.73 48.26,46.73 U1.45 | v50.29,36.07 51.43,34.93 U5.5
  Bottom 0.203: v49.29,46.73 v49.28,46.74 47.24,46.74 47.24,46.73 46.53,46.73 46.17,46.37 46.17,41 50.29,36.87 v50.29,36.07
SERVO_0_OUT
  Top 0.203: U5.8 49.38,23.88 48.26,23.88 46.99,22.61 R25.2
SERVO_1  (via drill 0.35)
  Top 0.203: v46.74,46.23 46.74,46.74 47.24,47.24 48.18,47.24 U1.46 | v51.82,35.81 52.32,35.31 52.32,30.48 54.24,28.57 U5.4
  Bottom 0.203: v46.74,46.23 46.74,45.65 46.5,45.41 46.5,44.99 46.99,44.5 46.99,40.64 v51.82,35.81
SERVO_1_OUT
  Top 0.203: U5.1 51.43,23.11 50.29,23.11 49.28,22.1 R26.2
TCK  (via drill 0.35)
  Top 0.203: v44.96,48.77 44.96,49.96 U1.52 | v37.59,29.46 37.59,23.37 22.15,7.92 22.15,4.62 21.85,4.32 21.08,4.32 20.32,5.08 J1.4
  Bottom 0.203: v37.59,29.46 37.59,33.02 35.81,34.8 35.81,37.85 43.18,45.21 43.18,47.75 43.69,48.26 44.7,48.26 44.96,48.51 v44.96,48.77
TDI  (via drill 0.35)
  Top 0.203: v43.92,47.24 43.69,47.24 38.61,42.16 38.61,40.64 28.7,30.73 28.7,17.78 23.37,12.45 v23.37,12.19 | v45.97,47.75 45.92,47.8 U1.50 | v23.12,7.93 22.86,7.67 J1.8
  Bottom 0.203: v43.92,47.24 45.47,47.24 v45.97,47.75 | v23.37,12.19 23.37,8.13 23.17,7.93 v23.12,7.93
TDO  (via drill 0.35)
  Top 0.203: v36.58,36.83 36.58,23.88 21.59,8.89 J1.6 | U1.49 46.42,48.02 46.48,47.96 46.48,47.49 v45.47,46.48
  Bottom 0.203: v36.58,36.83 45.47,45.72 v45.47,46.48
TMS  (via drill 0.35)
  Top 0.203: v39.62,26.42 39.37,26.16 39.37,23.88 23.62,8.13 23.62,7.62 23.57,7.58 23.57,4.52 22.69,3.64 20.07,3.64 19.05,4.66 J1.2 | v45.47,44.7 44.96,45.21 44.96,48.05 45.46,48.56 45.46,48.98 45.42,49.02 U1.51
  Bottom 0.203: v39.62,26.42 39.88,26.67 45.72,26.67 46.99,27.94 46.99,34.04 45.47,35.56 v45.47,44.7
USB_D+  (via drill 0.35)
  Top 0.203: U1.44 48.25,46.23 v49.78,46.23 | J7.3 82.47,46.48 D9.2 82.22,46.74 v80.77,46.74
  Bottom 0.203: v49.78,46.23 80.26,46.23 v80.77,46.74
USB_D-  (via drill 0.35)
  Top 0.203: U1.43 49.63,45.7 v49.78,45.55 | v80.52,45.47 82.22,45.47 D8.2 82.59,45.83 J7.2
  Bottom 0.203: v49.78,45.55 50.12,45.55 50.47,45.9 80.09,45.9 v80.52,45.47
VMOT_EN  (via drill 0.35)
  Top 0.203: U1.31 45.92,40.08 45.97,40.13 v45.97,40.39 | v68.58,64.77 68.58,65.79 69.6,66.8 69.6,68.83 70.36,69.6 U12.7 71.23,70.32 71.24,70.32 73.15,72.23 73.15,74.93 74.17,75.95 R23.2 C40.2
  Route2 0.203: v45.97,40.39 45.97,40.64 50.29,44.95 50.29,46.44 50.04,46.69 50.04,53.85 58.17,61.98 66.8,61.98 68.58,63.75 v68.58,64.77

### Text on the board
tPlace: + | MOTOR 1 | EPS | USB | MOTOR 0 | CSTER CUBESAT ROBOTIC ARM V0.3 | https://volt.utep.edu/csetr/ | VMOT ON | RESET | + | MOTOR 3 | MOTOR 2 | JTAG